# EAGLE board HFT-Core-Module_1V0 (EAGLE 7.7.0), part 1 of 3
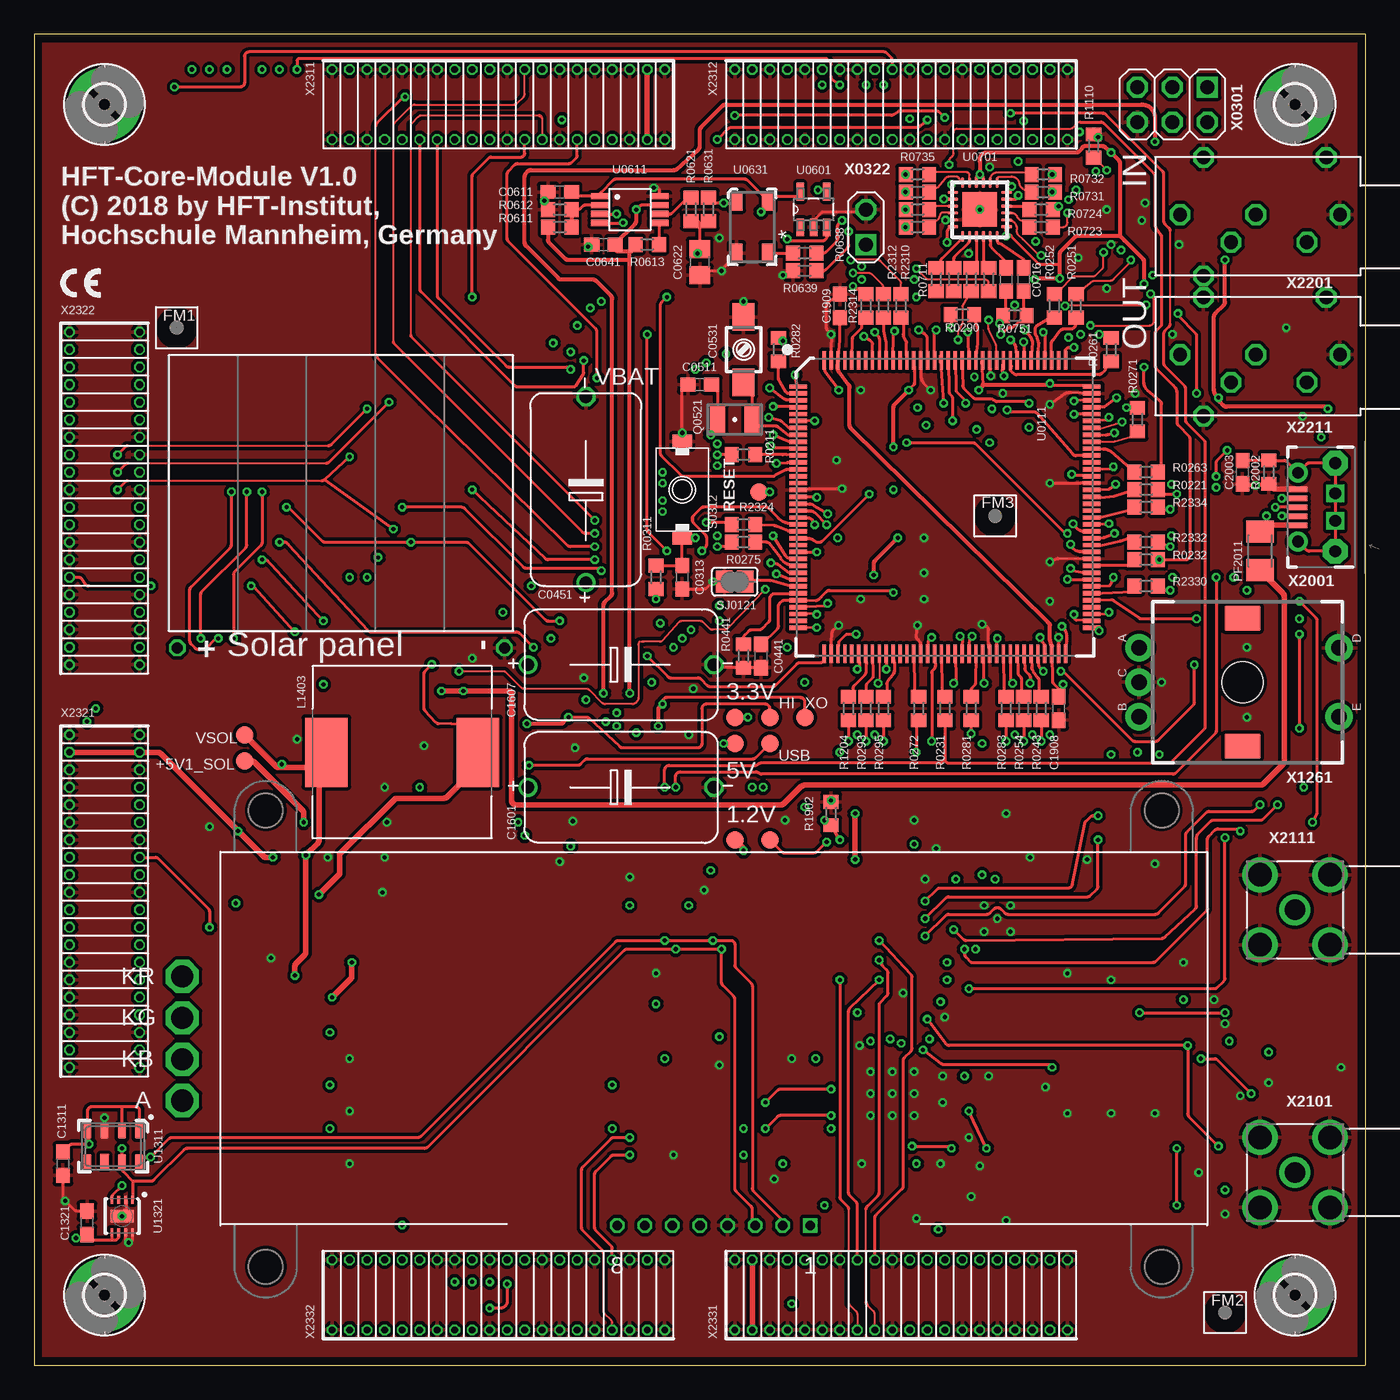
[diagram p24: board, top side]
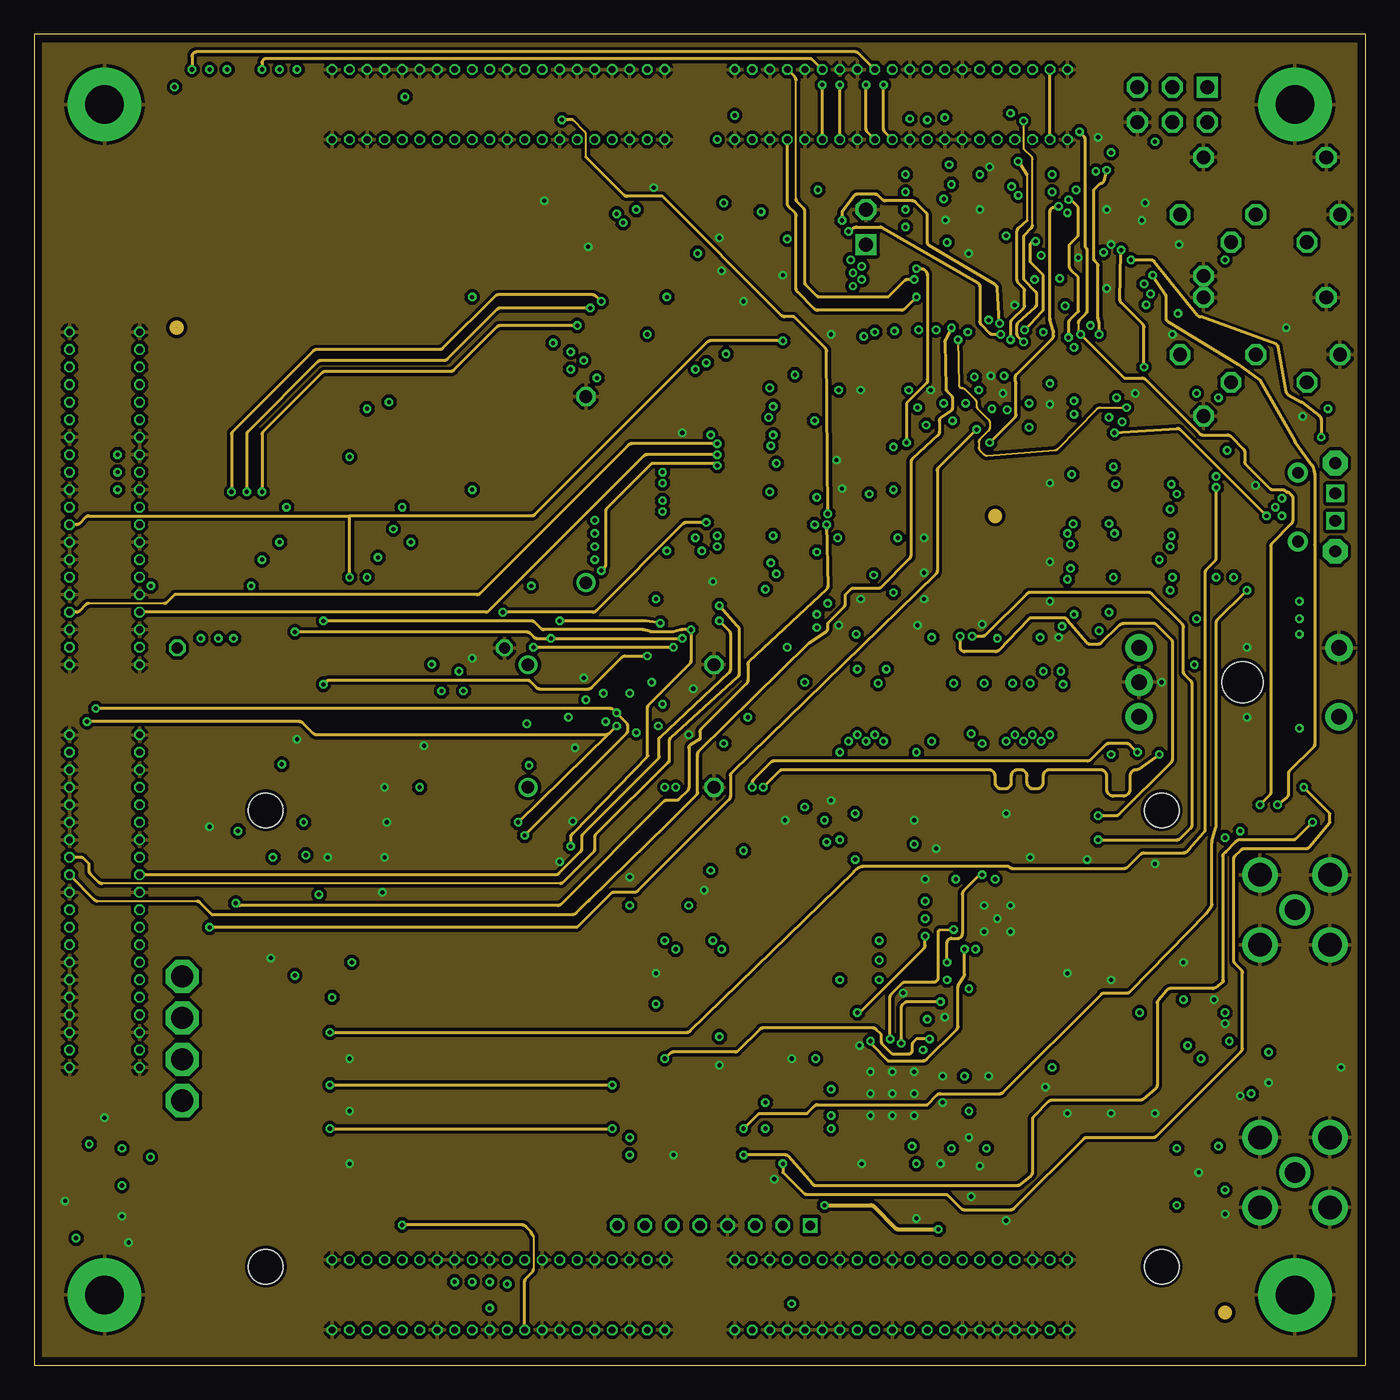
[diagram p25: board, inner layer Layer_2]
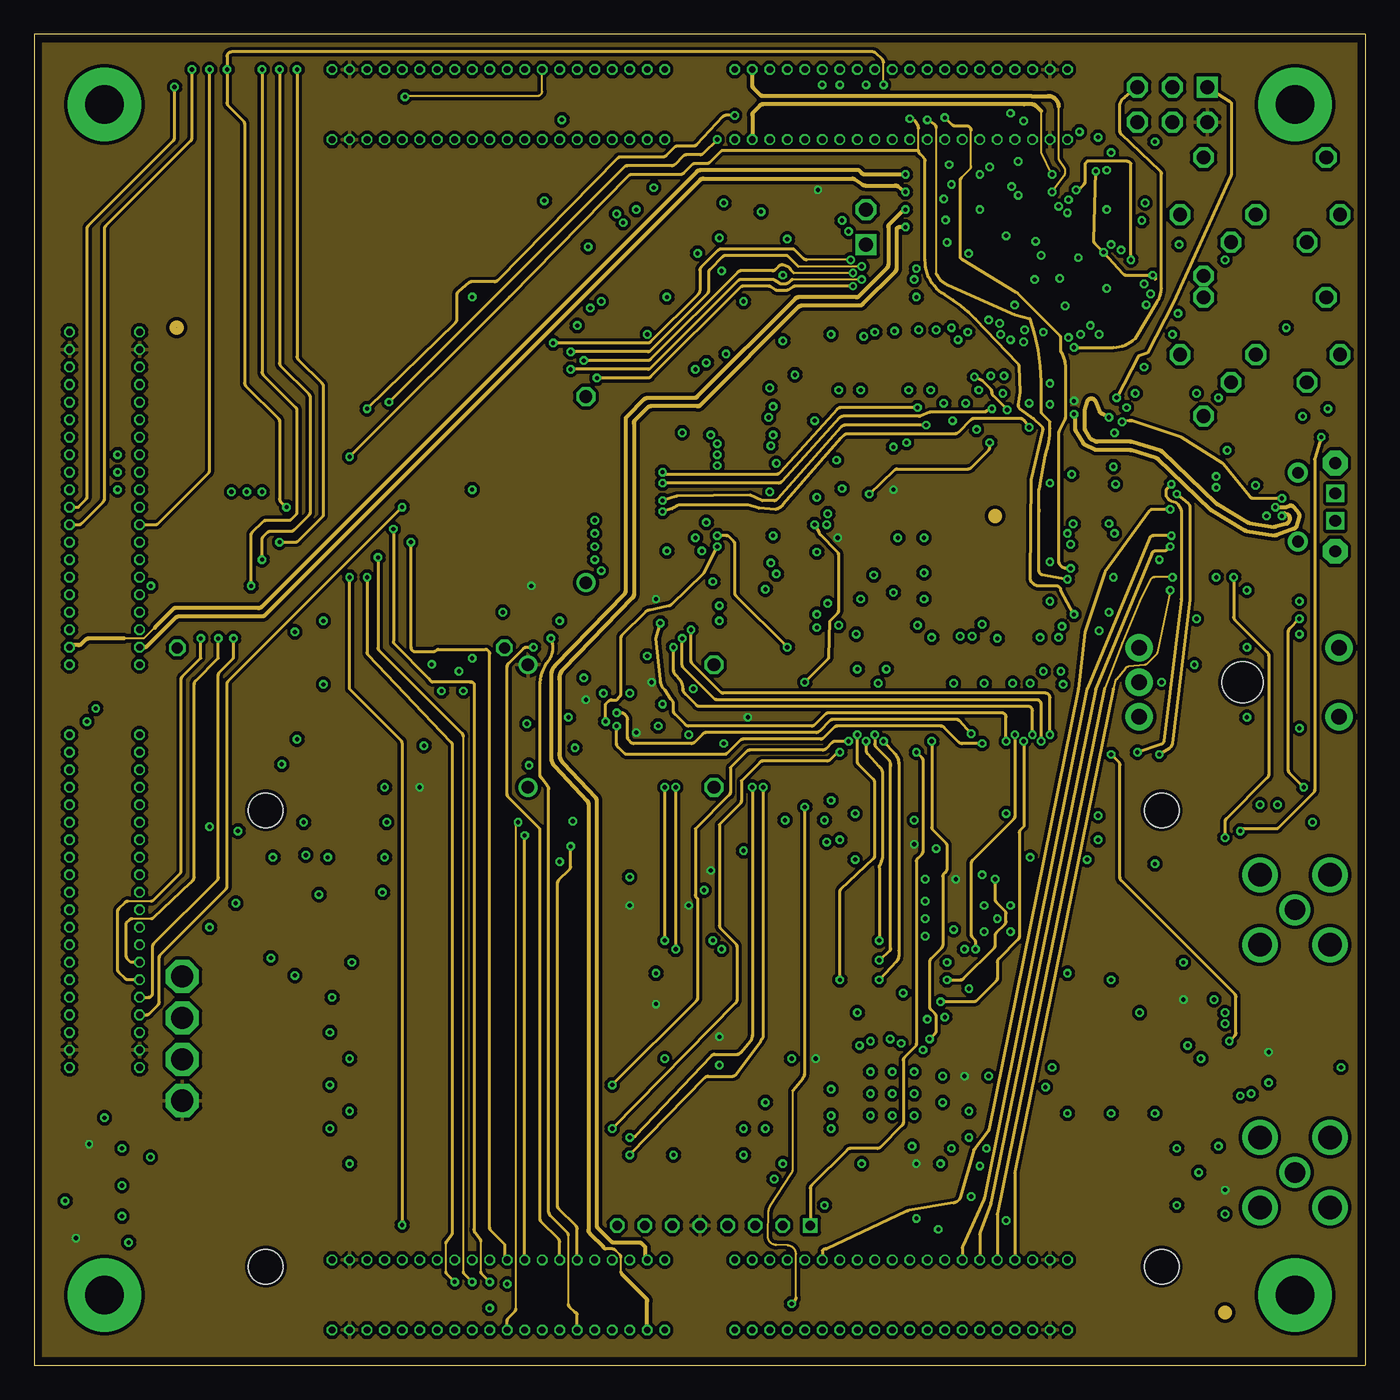
[diagram p26: board, inner layer Layer_15]
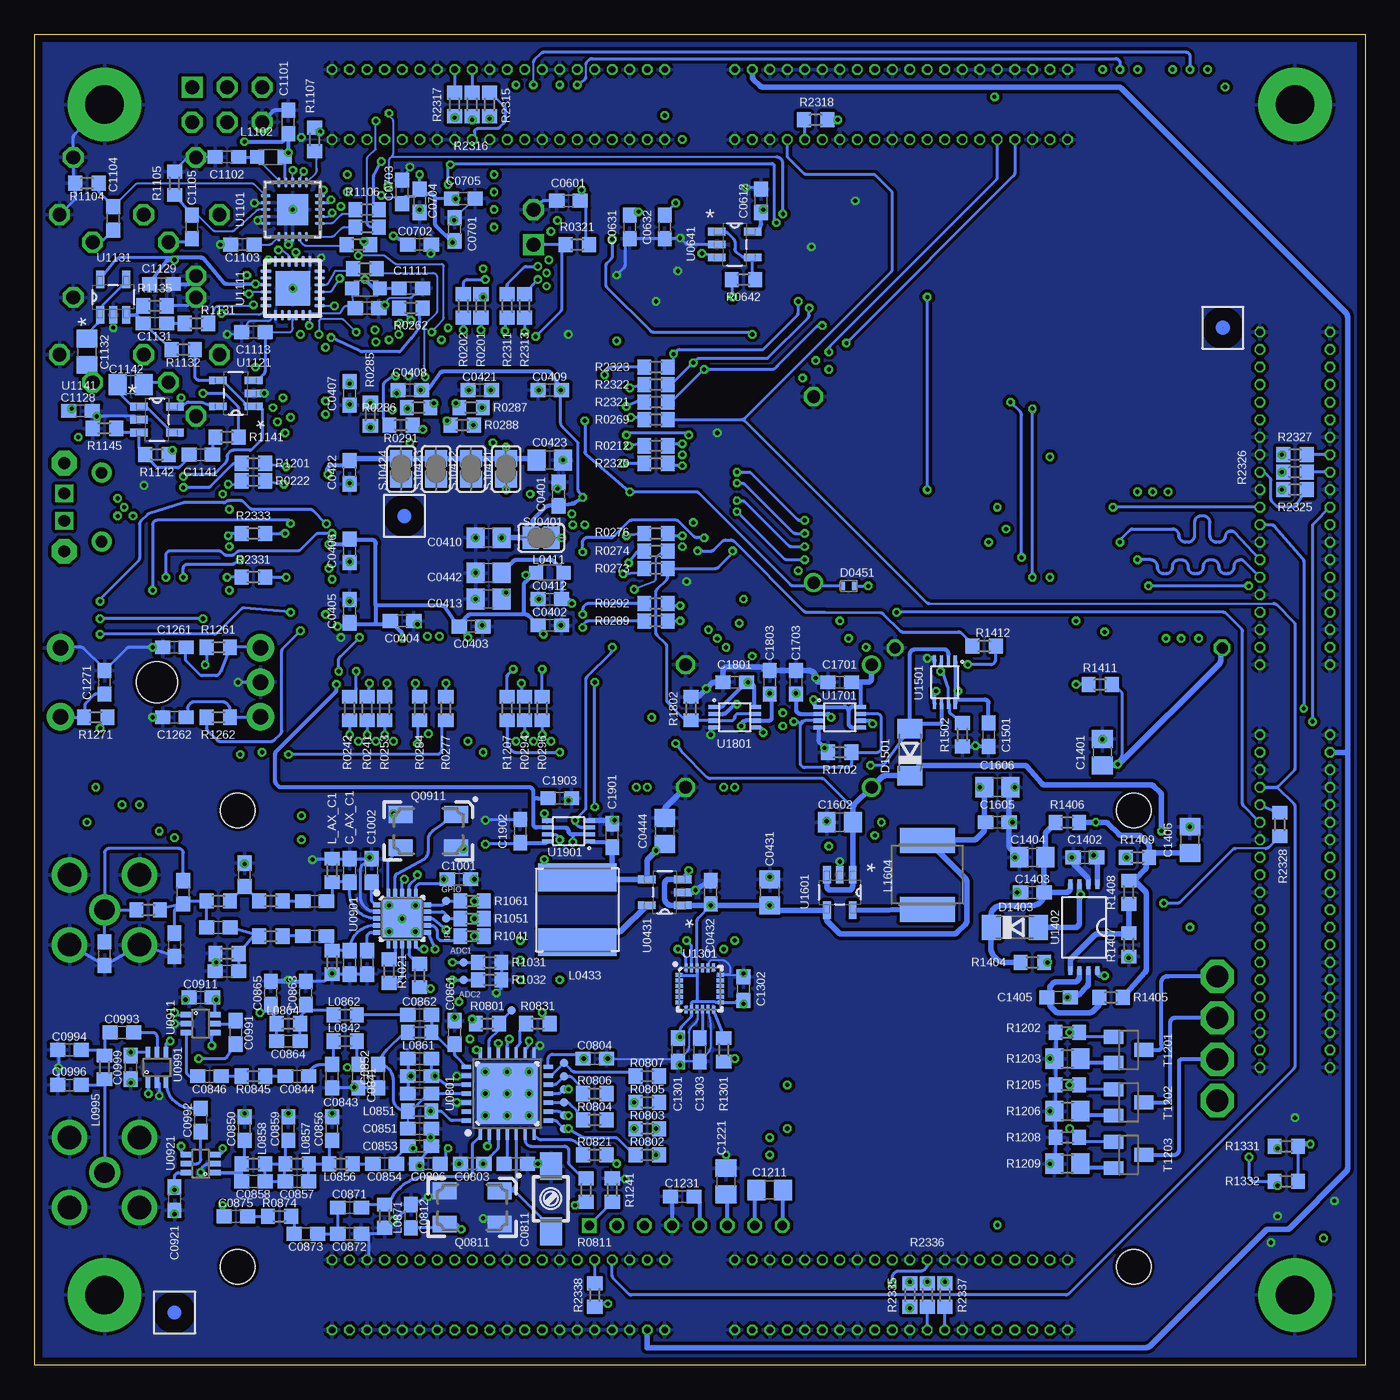
[diagram p27: board, bottom side, seen from below]

Size 96.52 x 96.52 mm. Coordinates in mm from the lower left corner, seen from the top.
Outline: 0,0 96.52,0 96.52,96.52 0,96.52 0,0
Copper layers ((1*2)+(15*16)): Top 0.035mm / dielectric 0.65mm / Layer_2 0.035mm / dielectric 0.15mm / Layer_15 0.035mm / dielectric 0.65mm / Bottom 0.035mm
Design rules "DirtyPCBs_4layers_6mil_20150401 *": minimum track width 6mil, minimum drill 12mil, track to track 0.25mm, track to pad 0.25mm, pad to pad 6mil, via to via 6mil, smd to smd 0mil, copper to edge 10mil, drill to drill 10mil, minimum pad ring 5mil, minimum via ring 6mil, stop-mask expansion 2mil, vias tented up to drill 25mil, thermal gap 10mil
Net classes: 1 pwr_relay: width 1.5 mm, clearance 0.5 mm; 2 pwr_ttl: width 0.75 mm, clearance 0.5 mm; 4 pwrA5: width 0.4 mm; 7 +3V3: clearance 0.5 mm; 8 GND: clearance 0.5 mm

## Footprints (pad centres in the part's own frame; a part is rotated, then mirrored left to right if it is on the bottom)
C0603 = smd 1.1 x 1: 1 -0.85,0; 2 0.85,0
C0805 = smd 1.3 x 1.5: 1 -0.95,0; 2 0.95,0
W14MM_D8MM_P13MM5 = drill 0.914: + -6.75,0 | drill 0.914 octagon: - 6.75,0
3MM2_X_2MM5 = smd 2 x 1.6: + -2.365,0; - 2.365,0
SOD923 = smd 0.4 x 0.6: A 0.45,0; C -0.45,0
SOD80C = smd 1.4 x 1.8: A 1.7,0; C -1.7,0
2,8-PAD = drill 2.8 pad 5.334: B2,8 0,0
L2012C = smd 1 x 1: 1 -1,0; 2 1,0
L_6X6MM = smd 2 x 5.7: 1 -2.35,0; 2 2.35,0
R0603 = smd 1 x 1.1: 1 -0.85,0; 2 0.85,0
L_13.5X12.5MM = smd 3.1 x 5: 1 -5.5,0; 2 5.5,0
L5650M = smd 1.8 x 4: 1 -2.5,0; 2 2.5,0
M1206 = smd 1.6 x 2: 1 -1.4,0; 2 1.4,0
ABS07 = smd 1.1 x 1.9: 1 -1.25,0; 2 1.25,0
ABM03B = smd 1.8 x 1.2: 1 -2,-1.2; 2 2,-1.2; 3 2,1.2; 4 -2,1.2
R0805 = smd 1.3 x 1.5: 1 -0.95,0; 2 0.95,0
KSR223G_SMD_1POL = smd 1 x 1.4: 1 -3.5,0; 2 3.5,0
SJ = smd 1.168 x 1.6: 1 -0.762,0; 2 0.762,0
SOT23 = smd 1 x 1.4: 1 -0.95,-1.1; 2 0.95,-1.1; 3 0,1.1
B1,27 = smd 1.27 x 1.27: TP 0,0
TP06R = smd 0.6 x 0.6: TP 0,0
LQFP144 = smd 0.325 x 1.35: 1 -8.75,-10.65; 2 -8.25,-10.65; 3 -7.75,-10.65; 4 -7.25,-10.65; 5 -6.75,-10.65; 6 -6.25,-10.65; 7 -5.75,-10.65; 8 -5.25,-10.65; 9 -4.75,-10.65; 10 -4.25,-10.65; 11 -3.75,-10.65; 12 -3.25,-10.65; 13 -2.75,-10.65; 14 -2.25,-10.65; 15 -1.75,-10.65; 16 -1.25,-10.65; 17 -0.75,-10.65; 18 -0.25,-10.65; 19 0.25,-10.65; 20 0.75,-10.65; 21 1.25,-10.65; 22 1.75,-10.65; 23 2.25,-10.65; 24 2.75,-10.65; 25 3.25,-10.65; 26 3.75,-10.65; 27 4.25,-10.65; 28 4.75,-10.65; 29 5.25,-10.65; 30 5.75,-10.65; 31 6.25,-10.65; 32 6.75,-10.65; 33 7.25,-10.65; 34 7.75,-10.65; 35 8.25,-10.65; 36 8.75,-10.65; 73 8.75,10.65; 74 8.25,10.65; 75 7.75,10.65; 76 7.25,10.65; 77 6.75,10.65; 78 6.25,10.65; 79 5.75,10.65; 80 5.25,10.65; 81 4.75,10.65; 82 4.25,10.65; 83 3.75,10.65; 84 3.25,10.65; 85 2.75,10.65; 86 2.25,10.65; 87 1.75,10.65; 88 1.25,10.65; 89 0.75,10.65; 90 0.25,10.65; 91 -0.25,10.65; 92 -0.75,10.65; 93 -1.25,10.65; 94 -1.75,10.65; 95 -2.25,10.65; 96 -2.75,10.65; 97 -3.25,10.65; 98 -3.75,10.65; 99 -4.25,10.65; 100 -4.75,10.65; 101 -5.25,10.65; 102 -5.75,10.65; 103 -6.25,10.65; 104 -6.75,10.65; 105 -7.25,10.65; 106 -7.75,10.65; 107 -8.25,10.65; 108 -8.75,10.65 | smd 1.35 x 0.325: 37 10.65,-8.75; 38 10.65,-8.25; 39 10.65,-7.75; 40 10.65,-7.25; 41 10.65,-6.75; 42 10.65,-6.25; 43 10.65,-5.75; 44 10.65,-5.25; 45 10.65,-4.75; 46 10.65,-4.25; 47 10.65,-3.75; 48 10.65,-3.25; 49 10.65,-2.75; 50 10.65,-2.25; 51 10.65,-1.75; 52 10.65,-1.25; 53 10.65,-0.75; 54 10.65,-0.25; 55 10.65,0.25; 56 10.65,0.75; 57 10.65,1.25; 58 10.65,1.75; 59 10.65,2.25; 60 10.65,2.75; 61 10.65,3.25; 62 10.65,3.75; 63 10.65,4.25; 64 10.65,4.75; 65 10.65,5.25; 66 10.65,5.75; 67 10.65,6.25; 68 10.65,6.75; 69 10.65,7.25; 70 10.65,7.75; 71 10.65,8.25; 72 10.65,8.75; 109 -10.65,8.75; 110 -10.65,8.25; 111 -10.65,7.75; 112 -10.65,7.25; 113 -10.65,6.75; 114 -10.65,6.25; 115 -10.65,5.75; 116 -10.65,5.25; 117 -10.65,4.75; 118 -10.65,4.25; 119 -10.65,3.75; 120 -10.65,3.25; 121 -10.65,2.75; 122 -10.65,2.25; 123 -10.65,1.75; 124 -10.65,1.25; 125 -10.65,0.75; 126 -10.65,0.25; 127 -10.65,-0.25; 128 -10.65,-0.75; 129 -10.65,-1.25; 130 -10.65,-1.75; 131 -10.65,-2.25; 132 -10.65,-2.75; 133 -10.65,-3.25; 134 -10.65,-3.75; 135 -10.65,-4.25; 136 -10.65,-4.75; 137 -10.65,-5.25; 138 -10.65,-5.75; 139 -10.65,-6.25; 140 -10.65,-6.75; 141 -10.65,-7.25; 142 -10.65,-7.75; 143 -10.65,-8.25; 144 -10.65,-8.75
SOT95P280X145-5N = smd 1.27 x 0.559: 1 -1.295,0.94; 2 -1.295,0; 3 -1.295,-0.94; 4 1.295,-0.94; 5 1.295,0.94
SOT95P285X120-5N = smd 1.27 x 0.533: 1 -1.295,0.965; 2 -1.295,0; 3 -1.295,-0.965; 4 1.295,-0.965; 5 1.295,0.965
µMAX8 = smd 1.35 x 0.4: 1 -2.15,0.975; 2 -2.15,0.325; 3 -2.15,-0.325; 4 -2.15,-0.975; 5 2.15,-0.975; 6 2.15,-0.325; 7 2.15,0.325; 8 2.15,0.975
CFPT-141 = smd 0.9 x 1.4: 1 -1.15,1.9; 2 -1.15,-1.9; 3 1.15,-1.9; 4 1.15,1.9
SOT-23-5 = smd 1.27 x 0.559: 1 -1.295,0.94; 2 -1.295,0; 3 -1.295,-0.94; 4 1.295,-0.94; 5 1.295,0.94
QFN24_P0MM5_CTRPAD = smd 0.8 x 0.25: 1 -1.95,1.25; 2 -1.95,0.75; 3 -1.95,0.25; 4 -1.95,-0.25; 5 -1.95,-0.75; 6 -1.95,-1.25; 13 1.95,-1.25; 14 1.95,-0.75; 15 1.95,-0.25; 16 1.95,0.25; 17 1.95,0.75; 18 1.95,1.25 | smd 0.25 x 0.8: 7 -1.25,-1.95; 8 -0.75,-1.95; 9 -0.25,-1.95; 10 0.25,-1.95; 11 0.75,-1.95; 12 1.25,-1.95; 19 1.25,1.95; 20 0.75,1.95; 21 0.25,1.95; 22 -0.25,1.95; 23 -0.75,1.95; 24 -1.25,1.95 | smd 2.5 x 2.5: 25 0,0
QFN28-6X6-0P65-PAD = smd 0.75 x 0.3: 1 -2.975,1.95; 2 -2.975,1.3; 3 -2.975,0.65; 4 -2.975,0; 5 -2.975,-0.65; 6 -2.975,-1.3; 7 -2.975,-1.95; 15 2.975,-1.95; 16 2.975,-1.3; 17 2.975,-0.65; 18 2.975,0; 19 2.975,0.65; 20 2.975,1.3; 21 2.975,1.95 | smd 0.3 x 0.75: 8 -1.95,-2.975; 9 -1.3,-2.975; 10 -0.65,-2.975; 11 0,-2.975; 12 0.65,-2.975; 13 1.3,-2.975; 14 1.95,-2.975; 22 1.95,2.975; 23 1.3,2.975; 24 0.65,2.975; 25 0,2.975; 26 -0.65,2.975; 27 -1.3,2.975; 28 -1.95,2.975 | smd 4.4 x 4.4: 29 0,0
QFN20-4X4-0P5-PAD = smd 0.6 x 0.35: 1 -1.85,1; 2 -1.85,0.5; 3 -1.85,0; 4 -1.85,-0.5; 5 -1.85,-1; 11 1.85,-1; 12 1.85,-0.5; 13 1.85,0; 14 1.85,0.5; 15 1.85,1 | smd 0.35 x 0.6: 6 -1,-1.85; 7 -0.5,-1.85; 8 0,-1.85; 9 0.5,-1.85; 10 1,-1.85; 16 1,1.85; 17 0.5,1.85; 18 0,1.85; 19 -0.5,1.85; 20 -1,1.85 | smd 2.75 x 2.75: 21 0,0
SC-70_6-LEAD_2X1MM25_0P65 = smd 0.4 x 0.9: 1 -0.65,-1.05; 2 0,-1.05; 3 0.65,-1.05; 4 0.65,1.05; 5 0,1.05; 6 -0.65,1.05
QFN20_P0MM5_CTRPAD = smd 0.73 x 0.25: 1 -1.965,1; 2 -1.965,0.5; 3 -1.965,0; 4 -1.965,-0.5; 5 -1.965,-1; 11 1.965,-1; 12 1.965,-0.5; 13 1.965,0; 14 1.965,0.5; 15 1.965,1 | smd 0.25 x 0.73: 6 -1,-1.965; 7 -0.5,-1.965; 8 0,-1.965; 9 0.5,-1.965; 10 1,-1.965; 16 1,1.965; 17 0.5,1.965; 18 0,1.965; 19 -0.5,1.965; 20 -1,1.965 | smd 2.25 x 2.25: 21 0,0
NHD-C0220BIZ_2X20CHARS = drill 0.7 square: 1 7,-14 | drill 0.7 octagon: 2 5,-14; 3 3,-14; 4 1,-14; 5 -1,-14; 6 -3,-14; 7 -5,-14; 8 -7,-14 | drill 1.6 pad 2 octagon: 9 -38.55,4.05; 10 -38.55,1.05; 11 -38.55,-1.95; 12 -38.55,-4.95 | hole 2.5: -32.5,16.1; 32.5,16.1; 32.5,-17; -32.5,-17
QFN24-3X3 = smd 0.495 x 0.25: 1 -1.552,1; 6 -1.552,-1; 13 1.552,-1; 18 1.552,1 | smd 0.6 x 0.25: 2 -1.5,0.6; 3 -1.5,0.2; 4 -1.5,-0.2; 5 -1.5,-0.6; 14 1.5,-0.6; 15 1.5,-0.2; 16 1.5,0.2; 17 1.5,0.6 | smd 0.25 x 0.495: 7 -1,-1.552; 12 1,-1.552; 19 1,1.552; 24 -1,1.552 | smd 0.25 x 0.6: 8 -0.6,-1.5; 9 -0.2,-1.5; 10 0.2,-1.5; 11 0.6,-1.5; 20 0.6,1.5; 21 0.2,1.5; 22 -0.2,1.5; 23 -0.6,1.5
MS5607-02BA = smd 1.1 x 0.6: 1 -1.1,1.875; 2 -1.1,0.625; 3 -1.1,-0.625; 4 -1.1,-1.875; 5 1.1,-1.875; 7 1.1,0.625; 8 1.1,1.875 | smd 1.1 x 0.67: 6 1.1,-0.625
DFN8/SHT = smd 0.55 x 0.25: 1 -1.177,0.765; 2 -1.177,0.265; 3 -1.177,-0.235; 4 -1.177,-0.735; 5 1.173,-0.735; 6 1.173,-0.235; 7 1.173,0.265; 8 1.173,0.765 | smd 0.9 x 1.7: 9 -0.002,0.015
SOLARPANEL_3V3_5MA1_25MM_X_20MM = drill 0.8 octagon: +VSOL 11.23,-11.865; -VSOL 11.23,11.865
TSSOP8 = smd 0.305 x 0.61: 1 -0.892,-3.13; 2 -0.242,-3.13; 3 0.407,-3.13; 4 1.058,-3.13; 5 1.058,3.13; 6 0.407,3.13; 7 -0.242,3.13; 8 -0.892,3.13
R-PDSO-G8 = smd 0.25 x 0.75: 1 -0.75,-1.55; 2 -0.25,-1.55; 3 0.25,-1.55; 4 0.75,-1.55; 5 0.75,1.55; 6 0.25,1.55; 7 -0.25,1.55; 8 -0.75,1.55
2X03 = drill 1.016 square: 1 -2.54,-1.27 | drill 1.016 octagon: 2 -2.54,1.27; 3 0,-1.27; 4 0,1.27; 5 2.54,-1.27; 6 2.54,1.27
1X02 = drill 1.016 square: 1 0,0 | drill 1.016 octagon: 2 0,2.54
TTE_EN11-HSM = drill 1.1 pad 2: A -2.5,-7.5; B 2.5,-7.5; C 0,-7.5; D -2.5,7; E 2.5,7 | smd 1.8 x 2.6: NC1 -4.65,0; NC2 4.65,0 | hole 3: 0,0
USB-B-MICRO-SMD_MOLEX-105017-0001 = smd 0.4 x 1.35: D+ 0,4.15; D- -0.65,4.15; GND 1.3,4.15; ID 0.65,4.15; VBUS -1.3,4.15 | drill 0.85 pad 1.45: JSHIELD -2.5,4.15; JSHIELD@2 2.5,4.15 | drill 0.85 pad 1.8 octagon: JSHIELD@3 -3.2,1.45; JSHIELD@6 3.2,1.45 | drill 0.85 square: JSHIELD@4 -1,1.45; JSHIELD@5 1,1.45
SMA_SMT_AMPHENOL_901-143 = drill 1.499: 1 0,0 | drill 1.702: 2 -2.54,2.54; 3 -2.54,-2.54; 4 2.54,-2.54; 5 2.54,2.54
SJ1-353XNS_3MM5-STEREO-AUDIO-JACKS = drill 1 octagon: 1 -4.532,-0.9; 2 -2.132,1.1; 3 3.368,1.1; 4 7.067,-0.9; 5 1.567,-0.9; 6 5.367,3.55; 7 -3.533,-5.05; 8 5.367,-5.05
2X20/90_1MM27_HARWIN_M50-3202045 = drill 0.5 pad 0.762 octagon: 1 -12.7,-2.54; 2 -12.7,2.54; 3 -11.43,-2.54; 4 -11.43,2.54; 5 -10.16,-2.54; 6 -10.16,2.54; 7 -8.89,-2.54; 8 -8.89,2.54; 9 -7.62,-2.54; 10 -7.62,2.54; 11 -6.35,-2.54; 12 -6.35,2.54; 13 -5.08,-2.54; 14 -5.08,2.54; 15 -3.81,-2.54; 16 -3.81,2.54; 17 -2.54,-2.54; 18 -2.54,2.54; 19 -1.27,-2.54; 20 -1.27,2.54; 21 0,-2.54; 22 0,2.54; 23 1.27,-2.54; 24 1.27,2.54; 25 2.54,-2.54; 26 2.54,2.54; 27 3.81,-2.54; 28 3.81,2.54; 29 5.08,-2.54; 30 5.08,2.54; 31 6.35,-2.54; 32 6.35,2.54; 33 7.62,-2.54; 34 7.62,2.54; 35 8.89,-2.54; 36 8.89,2.54; 37 10.16,-2.54; 38 10.16,2.54; 39 11.43,-2.54; 40 11.43,2.54

## Placement (x,y rotation side)
C0313  100nF  [C0603]  46.99,57.15 270 top
C0401  100n  [C0603]  58.5,63.18 90 bottom
C0402  100n  [C0603]  59.13,53.66 0 bottom
C0403  100n  [C0603]  64.85,53.58 0 bottom
C0404  100n  [C0603]  69.85,53.98 0 bottom
C0405  100n  [C0603]  73.66,54.69 90 bottom
C0406  100n  [C0603]  73.66,59.05 270 bottom
C0407  100n  [C0603]  73.66,70.48 270 bottom
C0408  100n  [C0603]  69.29,70.72 180 bottom
C0409  100n  [C0603]  59.13,70.72 180 bottom
C0410  4.7uF  [C0805]  63.58,60.01 180 bottom
C0412  10nF  [C0603]  59.13,55.56 180 bottom
C0413  1uF  [C0805]  63.58,57.47 180 bottom
C0421  100nF  [C0603]  64.21,70.72 0 bottom
C0422  100nF  [C0603]  73.66,64.77 270 bottom
C0423  4.7uF  [C0805]  59.13,65.64 0 bottom
C0431  10uF  [C0805]  43.18,34.29 90 bottom
C0432  100nF  [C0603]  47.47,34.29 90 bottom
C0441  100nF  [C0603]  52.7,51.44 90 top
C0442  1uF  [C0805]  63.58,55.56 0 bottom
C0444  10uF  [C0805]  50.8,38.73 90 bottom
C0451  1F_EEC-S5R5H105N  [W14MM_D8MM_P13MM5]  40.01,63.5 90 top
C0511  22pF  [C0603]  48.26,71.12 180 top
C0531  TZY2Z100AC01R00  [3MM2_X_2MM5]  51.44,73.66 270 top
C0601  100nF  [C0603]  57.78,84.45 180 bottom
C0611  100nF  [C0603]  38.1,85.09 180 top
C0612  100nF  [C0603]  43.81,84.45 90 bottom
C0622  1uF  [C0805]  48.26,80.01 270 top
C0631  100nF  [C0603]  53.34,82.55 270 bottom
C0632  100pF  [C0603]  50.8,82.55 270 bottom
C0641  100nF  [C0603]  41.27,81.28 180 top
C0701  100nF  [C0603]  66.04,82.39 90 bottom
C0702  100nF  [C0603]  68.58,81.28 0 bottom
C0703  100nF  [C0603]  69.85,85.09 90 bottom
C0704  220nF  [C0603]  68.58,84.45 270 bottom
C0705  100nF  [C0603]  65.41,84.61 180 bottom
C0715  10nF  [C0603]  70.48,78.74 90 top
C0716  10nF  [C0603]  71.75,78.74 90 top
C0801  1u  [C0603]  68.58,22.23 180 bottom
C0802  100n  [C0603]  68.58,20.95 0 bottom
C0803  100n  [C0603]  64.77,14.61 0 bottom
C0804  100n  [C0603]  55.88,22.23 180 bottom
C0805  100n  [C0603]  68.58,19.68 0 bottom
C0806  100n  [C0603]  67.94,14.61 0 bottom
C0807  100n  [C0603]  61.59,14.61 180 bottom
C0811  4.7p  [3MM2_X_2MM5]  59.05,12.06 270 bottom
C0812  12pF  [C0603]  69.22,10.79 270 bottom
C0841  0pF  [C0603]  73.03,20.95 270 bottom
C0843  3.3pF  [C0603]  74.93,20.95 270 bottom
C0844  47pF  [C0603]  77.47,20.95 180 bottom
C0846  47pF  [C0603]  83.82,20.95 180 bottom
C0850  0pF  [C0603]  81.28,17.14 90 bottom
C0851  47pF  [C0603]  68.58,17.14 0 bottom
C0852  47pF  [C0603]  71.6,20.95 270 bottom
C0853  4.7pF  [C0603]  68.58,15.88 0 bottom
C0854  15nH  [C0603]  71.12,14.61 180 bottom
C0856  6.8pF  [C0603]  74.93,17.14 90 bottom
C0857  2.7pF  [C0603]  77.47,13.34 180 bottom
C0858  0pF  [C0603]  80.64,13.34 180 bottom
C0859  6.8pF  [C0603]  78.11,17.14 90 bottom
C0861  1.5pF  [C0603]  66.04,24.13 90 bottom
C0862  33pF  [C0603]  68.58,25.4 180 bottom
C0863  4.7pF  [C0603]  76.83,26.99 90 bottom
C0864  1.2pF  [C0603]  78.11,23.5 180 bottom
C0865  1.8pF  [C0603]  79.38,26.99 90 bottom
C0871  4.7pF  [C0603]  73.66,11.43 180 bottom
C0872  0pF  [C0603]  73.66,9.53 180 bottom
C0873  47pF  [C0603]  76.83,9.53 180 bottom
C0875  47pF  [C0603]  81.92,10.79 180 bottom
C0911  1nF  [C0603]  84.45,26.67 180 bottom
C0921  1nF  [C0603]  86.36,12.06 270 bottom
C0991  100pF HiQ  [C0603]  81.92,24.13 270 bottom
C0992  330pF HiQ  [C0603]  84.45,17.78 90 bottom
C0993  330pF HiQ  [C0603]  90.17,24.13 180 bottom
C0994  0nF HiQ  [C0603]  93.98,22.86 180 bottom
C0996  0nF HiQ  [C0603]  93.98,20.32 180 bottom
C0999  1nF  [C0603]  89.53,21.59 270 bottom
C1001  100nF  [C0603]  65.72,35.24 0 bottom
C1002  100nF  [C0603]  72.07,35.88 270 bottom
C1003  100nF  [C0603]  72.39,29.21 90 bottom
C1101  100nF  [C0603]  78.11,90.17 90 bottom
C1102  100nF  [C0603]  82.55,87.63 0 bottom
C1103  100nF  [C0603]  81.44,81.28 0 bottom
C1104  220nF  [C0603]  90.81,83.19 90 bottom
C1105  220nF  [C0603]  85.09,82.55 90 bottom
C1111  100nF  [C0603]  69.22,78.11 0 bottom
C1112  100nF  [C0603]  72.39,76.68 180 bottom
C1113  47pF  [C0603]  80.64,74.93 180 bottom
C1128  100nF  [C0603]  93.19,69.22 0 bottom
C1129  100nF  [C0603]  87.31,78.42 0 bottom
C1131  220nF  [C0603]  87.79,75.56 180 bottom
C1132  100uF  [C0805]  92.71,73.5 270 bottom
C1141  220nF  [C0603]  84.45,66.04 180 bottom
C1142  100uF  [C0805]  89.53,71.12 0 bottom
C1211  1uF  [C0805]  43.18,12.7 180 bottom
C1221  1uF  [C0805]  46.35,13.34 90 bottom
C1231  100nF  [C0603]  49.53,12.22 180 bottom
C1261  1nF  [C0603]  86.36,52.07 180 bottom
C1262  1nF  [C0603]  86.36,46.99 180 bottom
C1271  1nF  [C0603]  91.44,49.53 90 bottom
C1301  100nF  [C0603]  49.85,22.86 270 bottom
C1302  10nF  [C0603]  45.09,27.3 90 bottom
C1303  100nF  [C0603]  48.26,22.86 270 bottom
C1311  100nF  [C0603]  2.06,14.61 270 top
C1321  100nF  [C0603]  3.81,10.32 90 top
C1401  100uF  [C0805]  19.05,44.45 90 bottom
C1402  100nF  [C0603]  20.32,36.83 180 bottom
C1403  100nF  [C0603]  24.13,34.29 180 bottom
C1404  10uF  [C0805]  24.13,36.83 180 bottom
C1405  0nF  [C0603]  22.23,26.67 180 bottom
C1406  47uF  [C0805]  12.7,38.1 90 bottom
C1501  100nF  [C0603]  27.3,45.72 270 bottom
C1601  1F_EEC-S5R5H105N  [W14MM_D8MM_P13MM5]  42.55,41.91 0 top
C1602  47uF  [C0805]  38.1,39.37 180 bottom
C1605  100nF  [C0603]  26.67,39.37 0 bottom
C1606  47uF  [C0805]  26.67,41.91 0 bottom
C1607  1F_EEC-S5R5H105N  [W14MM_D8MM_P13MM5]  42.55,50.8 0 top
C1701  100nF  [C0603]  38.1,49.53 180 bottom
C1703  100nF  [C0603]  41.27,49.53 90 bottom
C1801  100nF  [C0603]  45.72,49.53 180 bottom
C1803  100nF  [C0603]  43.18,49.53 90 bottom
C1901  100nF  [C0603]  54.61,38.42 90 bottom
C1902  100nF  [C0603]  61.28,38.73 90 bottom
C1903  100nF  [C0603]  58.42,41.12 0 bottom
C1908  100nF  [C0603]  74.3,47.62 90 top
C1909  100nF  [C0603]  58.42,76.83 90 top
C2003  1nF  [C0603]  87.63,64.77 90 top
C_AX_A2  4.7pF  [C0603]  86.36,30.48 270 bottom
C_AX_A3  4.7pF  [C0603]  91.44,29.84 270 bottom
C_AX_B2  4.7pF  [C0603]  83.19,31.75 180 bottom
C_AX_C1  0pF  [C0603]  73.66,35.88 90 bottom
C_AX_C2  0pF  [C0603]  73.66,29.21 270 bottom
C_AX_F2  4.7pF  [C0603]  85.72,34.29 90 bottom
C_AX_M1  4.7pF  [C0603]  81.28,35.56 90 bottom
C_AX_M2  0pF  [C0603]  82.55,28.57 180 bottom
C_AX_T1  4.3pF  [C0603]  76.2,33.66 180 bottom
C_AX_T2  4.3pF  [C0603]  76.2,31.11 180 bottom
D0451  CMAD6001  [SOD923]  37.47,56.52 0 bottom
D1403  CRS08  [SOD80C]  25.4,31.75 0 bottom
D1501  CRS08  [SOD80C]  33.02,44.45 90 bottom
FM1  [FIDUCIAL_MARK_1MM]  10.32,75.25 0 top
FM2  [FIDUCIAL_MARK_1MM]  86.36,3.81 0 top
FM3  [FIDUCIAL_MARK_1MM]  69.69,61.59 0 top
H2401  MOUNT-PAD-ROUND2.8  [2,8-PAD]  91.44,91.44 0 top
H2402  MOUNT-PAD-ROUND2.8  [2,8-PAD]  5.08,91.44 0 top
H2403  MOUNT-PAD-ROUND2.8  [2,8-PAD]  5.08,5.08 0 top
H2404  MOUNT-PAD-ROUND2.8  [2,8-PAD]  91.44,5.08 0 top
L0411  10uH  [L2012C]  59.13,57.47 180 bottom
L0433  2.2uH 14mR  [L_6X6MM]  57.15,33.02 270 bottom
L0842  10nH  [R0603]  73.98,23.5 180 bottom
L0851  68nH  [R0603]  68.58,18.41 180 bottom
L0856  0R  [R0603]  74.3,14.61 180 bottom
L0857  12nH  [R0603]  77.47,14.61 180 bottom
L0858  0R  [R0603]  80.64,14.61 180 bottom
L0861  33nH  [R0603]  68.58,24.13 180 bottom
L0862  10nH  [R0603]  73.98,25.4 180 bottom
L0864  6.2nH  [R0603]  78.11,24.77 180 bottom
L0871  18nH  [R0603]  71.12,10.79 270 bottom
L0995  0R  [R0603]  91.44,21.59 270 bottom
L1102  10uH  [L2012C]  79.38,87.63 0 bottom
L1112  10uH  [L2012C]  72.47,78.11 0 bottom
L1403  33uH  [L_13.5X12.5MM]  26.67,44.45 180 top
L1604  1.0uH 33mR  [L5650M]  31.75,35.56 270 bottom
L_AX_1  22nH  [R0603]  70.8,28.57 90 bottom
L_AX_B1  22nH  [R0603]  83.19,33.66 180 bottom
L_AX_B2  22nH  [R0603]  82.55,29.84 0 bottom
L_AX_C1  100nH  [R0603]  74.93,35.88 90 bottom
L_AX_C2  100nH  [R0603]  74.93,29.21 270 bottom
L_AX_F1  22nH  [R0603]  88.27,33.02 180 bottom
L_AX_T1  43nH  [R0603]  79.38,33.66 180 bottom
L_AX_T2  43nH  [R0603]  79.38,31.11 180 bottom
PF2011  1.1A/2.2A  [M1206]  88.9,59.05 270 top
Q0521  ABS07-32.768KHZ  [ABS07]  50.8,68.58 0 top
Q0811  ABM03B-32.000MHZ  [ABM03B]  64.77,11.43 180 bottom
Q0911  ABM3B-16MHZ-10-R50-1-U  [ABM03B]  67.94,38.73 180 bottom
R0201  0R  [R0603]  64.14,76.83 90 bottom
R0202  0R  [R0603]  65.41,76.83 90 bottom
R0211  0R  [R0603]  51.44,66.04 180 top
R0212  0R  [R0603]  51.44,66.67 0 bottom
R0221  0R  [R0603]  80.64,63.5 0 top
R0222  0R  [R0603]  80.64,64.14 180 bottom
R0231  0R  [R0603]  66.04,47.62 270 top
R0232  0R  [R0603]  80.64,58.42 0 top
R0241  47R  [R0603]  72.39,47.62 270 bottom
R0242  47R  [R0603]  73.66,47.62 270 bottom
R0243  47R  [R0603]  73.03,47.62 270 top
R0251  47R  [R0603]  75.56,76.83 90 top
R0252  47R  [R0603]  73.98,76.83 90 top
R0253  47R  [R0603]  71.12,47.62 270 bottom
R0254  47R  [R0603]  71.75,47.62 270 top
R0261  47R  [R0603]  78.11,73.66 90 top
R0262  47R  [R0603]  69.22,76.68 0 bottom
R0263  47R  [R0603]  80.64,64.77 0 top
R0269  47R  [R0603]  51.44,68.58 0 bottom
R0271  47R  [R0603]  80.01,68.58 90 top
R0272  47R  [R0603]  64.14,47.62 270 top
R0273  47R  [R0603]  51.44,57.78 0 bottom
R0274  47R  [R0603]  51.44,59.05 0 bottom
R0275  47R  [R0603]  51.44,59.69 180 top
R0276  47R  [R0603]  51.44,60.33 0 bottom
R0277  47R  [R0603]  66.67,47.62 270 bottom
R0281  47R  [R0603]  67.94,47.62 270 top
R0282  47R  [R0603]  53.98,73.66 90 top
R0283  47R  [R0603]  70.48,47.62 270 top
R0284  47R  [R0603]  68.58,47.62 270 bottom
R0285  47R  [R0603]  72.15,68.98 270 bottom
R0286  47R  [R0603]  68.66,69.45 180 bottom
R0287  47R  [R0603]  64.85,69.45 0 bottom
R0288  47R  [R0603]  65.48,68.18 0 bottom
R0289  47R  [R0603]  51.44,53.98 0 bottom
R0290  47R  [R0603]  67.31,76.2 180 top
R0291  47R  [R0603]  69.93,68.18 0 bottom
R0292  47R  [R0603]  51.44,55.24 0 bottom
R0293  47R  [R0603]  60.33,47.62 270 top
R0294  47R  [R0603]  60.96,47.62 270 bottom
R0295  47R  [R0603]  61.59,47.62 270 top
R0296  47R  [R0603]  59.69,47.62 270 bottom
R0311  N/A  [R0603]  45.09,57.15 90 top
R0321  10kR  [R0603]  57.15,81.28 180 bottom
R0441  0R  [R0603]  51.44,51.44 90 top
R0611  open  [R0603]  38.1,82.55 0 top
R0612  0R  [R0603]  38.1,83.82 0 top
R0613  0R  [R0603]  44.45,81.28 0 top
R0621  100kR  [R0603]  47.62,83.82 270 top
R0631  10kR  [R0603]  48.9,83.82 90 top
R0638  50R  [R0603]  55.88,80.64 0 top
R0639  50R  [R0603]  55.88,79.38 0 top
R0642  47R  [R0603]  45.09,78.74 180 bottom
R0711  none  [R0603]  65.41,78.74 90 top
R0712  none  [R0603]  66.67,78.74 90 top
R0713  47R  [R0603]  67.94,78.74 90 top
R0714  47R  [R0603]  69.22,78.74 90 top
R0723  47R  [R0603]  73.03,82.55 180 top
R0724  47R  [R0603]  73.03,83.82 180 top
R0731  47R  [R0603]  73.18,85.09 0 top
R0732  47R  [R0603]  73.18,86.36 0 top
R0735  47R  [R0603]  64.06,86.36 180 top
R0736  47R  [R0603]  64.06,85.09 180 top
R0743  47R  [R0603]  64.06,83.82 180 top
R0744  47R  [R0603]  64.06,82.55 180 top
R0751  100R  [R0603]  71.12,76.12 180 top
R0801  100R  [R0603]  63.66,24.77 180 bottom
R0802  47R  [R0603]  52.07,15.24 0 bottom
R0803  47R  [R0603]  52.07,17.14 0 bottom
R0804  NC  [R0603]  55.88,17.78 0 bottom
R0805  NC  [R0603]  52.07,19.05 0 bottom
R0806  NC  [R0603]  55.88,19.68 0 bottom
R0807  NC  [R0603]  52.07,20.95 0 bottom
R0811  0R  [R0603]  56.52,12.7 270 bottom
R0821  100R  [R0603]  55.88,15.24 180 bottom
R0831  47R  [R0603]  60.01,24.77 180 bottom
R0845  0R  [R0603]  80.64,20.95 180 bottom
R0874  0R  [R0603]  78.74,10.79 180 bottom
R1021  47R  [R0603]  68.58,28.26 270 bottom
R1031  100kR  [R0603]  63.5,29.21 0 bottom
R1032  100kR  [R0603]  63.5,27.94 0 bottom
R1041  47R  [R0603]  64.77,31.11 180 bottom
R1051  47R  [R0603]  64.77,32.38 180 bottom
R1061  47R  [R0603]  64.77,33.66 180 bottom
R1104  22kR  [R0603]  92.71,85.72 0 bottom
R1105  22kR  [R0603]  86.36,85.72 270 bottom
R1106  47R  [R0603]  72.39,83.82 0 bottom
R1107  47R  [R0603]  76.2,88.9 90 bottom
R1108  47R  [R0603]  72.39,82.55 0 bottom
R1109  47R  [R0603]  73.03,81.28 0 bottom
R1110  33kR  [R0603]  76.83,88.42 270 top
R1114  47R  [R0603]  72.55,79.53 180 bottom
R1131  10kR  [R0603]  84.77,75.56 180 bottom
R1132  10MR  [R0603]  85.72,73.66 180 bottom
R1135  10MR  [R0603]  87.79,76.83 180 bottom
R1141  10kR  [R0603]  82.55,67.31 180 bottom
R1142  10MR  [R0603]  87.63,66.04 180 bottom
R1145  10MR  [R0603]  91.44,67.94 0 bottom
R1201  2.0kR  [R0603]  80.64,65.41 0 bottom
R1202  1.5kR  [R0603]  21.59,24.13 0 bottom
R1203  27R  [R0805]  21.59,22.23 0 bottom
R1204  2.0kR  [R0603]  59.05,47.62 90 top
R1205  1.5kR  [R0603]  21.59,20.32 0 bottom
R1206  27R  [R0805]  21.59,18.41 0 bottom
R1207  2.0kR  [R0603]  62.23,47.62 90 bottom
R1208  1.5kR  [R0603]  21.59,16.51 0 bottom
R1209  27R  [R0805]  21.59,14.61 0 bottom
R1241  33kR  [R0603]  54.61,12.7 270 bottom
R1261  10kR  [R0603]  83.19,52.07 180 bottom
R1262  10kR  [R0603]  83.19,46.99 180 bottom
R1271  10kR  [R0603]  92.08,46.99 0 bottom
R1301  68R  [R0603]  46.51,22.86 270 bottom
R1331  1.0kR  [R0603]  5.71,15.88 0 bottom
R1332  1.0kR  [R0603]  5.71,13.34 0 bottom
R1404  0R  [R0603]  24.13,29.21 180 bottom
R1405  0R  [R0603]  18.41,26.67 0 bottom
R1406  0R  [R0603]  21.59,39.37 0 bottom
R1407  100kR  [R0603]  17.14,30.48 90 bottom
R1408  310kR  [R0603]  17.14,34.29 90 bottom
R1409  0R  [R0603]  16.51,36.83 180 bottom
R1411  1kR  [R0603]  19.21,49.37 180 bottom
R1412  100kR  [R0603]  27.62,52.15 0 bottom
R1502  33kR  [R0603]  29.21,45.72 90 bottom
R1702  33kR  [R0603]  38.1,44.45 0 bottom
R1802  33kR  [R0603]  48.9,47.62 270 bottom
R1902  33kR  [R0603]  57.78,40.01 270 top
R2002  330kR  [R0603]  89.53,64.77 90 top
R2310  47R  [R0603]  62.87,76.83 90 top
R2311  47R  [R0603]  62.23,76.83 90 bottom
R2312  47R  [R0603]  61.59,76.83 90 top
R2313  47R  [R0603]  60.96,76.83 90 bottom
R2314  47R  [R0603]  60.33,76.83 90 top
R2315  47R  [R0603]  63.5,91.44 90 bottom
R2316  47R  [R0603]  64.77,91.44 90 bottom
R2317  47R  [R0603]  66.04,91.44 90 bottom
R2318  47R  [R0603]  39.85,90.33 180 bottom
R2320  47R  [R0603]  51.44,65.41 0 bottom
R2321  47R  [R0603]  51.44,69.85 0 bottom
R2322  47R  [R0603]  51.44,71.12 0 bottom
R2323  47R  [R0603]  51.44,72.39 0 bottom
R2324  47R  [R0603]  51.44,60.96 180 top
R2325  47R  [R0603]  5.08,63.5 0 bottom
R2326  47R  [R0603]  5.08,64.77 0 bottom
R2327  47R  [R0603]  5.08,66.04 0 bottom
R2328  47R  [R0603]  6.19,39.21 90 bottom
R2330  47R  [R0603]  80.64,56.52 0 top
R2331  47R  [R0603]  80.64,57.15 180 bottom
R2332  47R  [R0603]  80.64,59.69 0 top
R2333  47R  [R0603]  80.64,60.33 180 bottom
R2334  47R  [R0603]  80.64,62.23 0 top
R2335  47R  [R0603]  33.02,5.08 270 bottom
R2336  47R  [R0603]  31.75,5.08 270 bottom
R2337  47R  [R0603]  30.48,5.08 270 bottom
R2338  47R  [R0603]  55.88,5.08 90 bottom
S0312  KSR223G  [KSR223G_SMD_1POL]  46.99,63.5 270 top
SJ0121  [SJ]  50.8,56.83 0 top
SJ0401  [SJ]  59.77,60.01 180 bottom
SJ0421  [SJ]  62.31,65.01 270 bottom
SJ0422  [SJ]  64.85,65.01 270 bottom
SJ0423  [SJ]  67.39,65.01 270 bottom
SJ0424  [SJ]  69.93,65.01 270 bottom
T1201  MMBT2222  [SOT23]  17.14,22.86 270 bottom
T1202  MMBT2222  [SOT23]  17.14,19.05 270 bottom
T1203  MMBT2222  [SOT23]  17.14,15.24 270 bottom
TP_+1V2  PTR1B1,27  [B1,27]  50.8,38.1 0 top
TP_+1V2_MCU  PTR1B1,27  [B1,27]  53.34,38.1 0 top
TP_+3V3  PTR1B1,27  [B1,27]  50.8,46.99 0 top
TP_+3V3_20MHZ  PTR1B1,27  [B1,27]  55.88,46.99 0 top
TP_+3V3_HICUR  PTR1B1,27  [B1,27]  53.34,46.99 0 top
TP_+5V0  PTR1B1,27  [B1,27]  50.8,45.09 0 top
TP_+5V0_SOL  PTR1B1,27  [B1,27]  15.24,43.81 0 top
TP_+5V0_USB_SW  PTR1B1,27  [B1,27]  53.34,45.09 0 top
TP_AX_ADC1  PTR1TP06R  [TP06R]  65.41,29.21 0 bottom
TP_AX_ADC2  PTR1TP06R  [TP06R]  65.41,27.94 0 bottom
TP_AX_IRQ  PTR1TP06R  [TP06R]  66.67,32.38 0 bottom
TP_AX_TCXO_EN  PTR1TP06R  [TP06R]  66.67,33.66 0 bottom
TP_SX_DIO0  PTR1TP06R  [TP06R]  58.1,17.14 0 bottom
TP_SX_DIO1  PTR1TP06R  [TP06R]  58.1,18.1 0 bottom
TP_SX_DIO2  PTR1TP06R  [TP06R]  58.1,19.05 0 bottom
TP_SX_DIO3  PTR1TP06R  [TP06R]  58.1,20 0 bottom
TP_SX_DIO4  PTR1TP06R  [TP06R]  58.1,20.95 0 bottom
TP_SX_DIO5  PTR1TP06R  [TP06R]  58.1,21.91 0 bottom
TP_SX_RXTX  PTR1TP06R  [TP06R]  61.91,25.72 0 bottom
TP_VBAT  PTR1B1,27  [B1,27]  52.55,63.34 0 top
TP_VSOL  PTR1B1,27  [B1,27]  15.24,45.72 0 top
U0111  STM32L4Z_144PIN_SMPS  [LQFP144]  66.04,62.23 270 top
U0431  PAM2305AAB120  [SOT95P280X145-5N]  50.8,34.29 180 bottom
U0601  LM4120IM5-3.0  [SOT95P285X120-5N]  56.52,83.82 90 top
U0611  MAX5217  [µMAX8]  43.18,83.82 0 top
U0631  CFPT-141-20MHZ  [CFPT-141]  52.07,82.55 0 top
U0641  OPA354  [SOT-23-5]  45.72,81.28 0 bottom
U0701  Si5338  [QFN24_P0MM5_CTRPAD]  68.58,83.82 90 top
U0801  SX1276  [QFN28-6X6-0P65-PAD]  62.23,19.68 90 bottom
U0901  AX5243  [QFN20-4X4-0P5-PAD]  69.85,32.38 0 bottom
U0911  PE4259  [SC-70_6-LEAD_2X1MM25_0P65]  84.45,24.77 270 bottom
U0921  PE4259  [SC-70_6-LEAD_2X1MM25_0P65]  84.45,14.61 90 bottom
U0991  PE4259  [SC-70_6-LEAD_2X1MM25_0P65]  87.63,21.59 0 bottom
U1101  MCP3911A0-E-SS  [QFN20_P0MM5_CTRPAD]  77.79,83.82 0 bottom
U1111  MAX5136AGTG+  [QFN24_P0MM5_CTRPAD]  77.79,78.11 180 bottom
U1121  OPA354  [SOT-23-5]  81.92,70.48 180 bottom
U1131  OPA354  [SOT-23-5]  90.81,77.47 90 bottom
U1141  OPA354  [SOT-23-5]  87.63,68.58 0 bottom
U1201  NHD-C0220BIZ_2X20CHARS  [NHD-C0220BIZ_2X20CHARS]  49.28,24.13 0 top
U1301  MPU-9250  [QFN24-3X3]  48.26,27.3 0 bottom
U1311  MS5607-02BA03  [MS5607-02BA]  5.71,15.88 270 top
U1321  SHT31-DIS  [DFN8/SHT]  6.35,10.79 270 top
U1401  SOLARPANEL_3V3_5MA1_25MM_X_20MM  [SOLARPANEL_3V3_5MA1_25MM_X_20MM]  22.23,63.25 270 top
U1402  SPV1040T  [TSSOP8]  20.32,31.75 180 bottom
U1501  TS5A23166  [R-PDSO-G8]  30.48,49.53 180 bottom
U1601  SC189ZSKTRT  [SOT95P280X145-5N]  38.1,34.29 270 bottom
U1701  TS5A23166  [R-PDSO-G8]  38.1,46.99 270 bottom
U1801  TS5A23166  [R-PDSO-G8]  45.72,46.99 270 bottom
U1901  TS5A23166  [R-PDSO-G8]  57.78,38.73 90 bottom
X0301  [2X03]  82.55,91.44 180 top
X0322  [1X02]  60.33,81.28 0 top
X1261  TTE_EN11-HSM  [TTE_EN11-HSM]  87.63,49.53 270 top
X2001  MOLEX 105017-0001  [USB-B-MICRO-SMD_MOLEX-105017-0001]  95.81,62.23 90 top
X2101  SMA_SMT_AMPHENOL-901-143, SAMTEC SMA-J-P-H-RA-TH1  [SMA_SMT_AMPHENOL_901-143]  91.44,13.97 270 top
X2111  SMA_SMT_AMPHENOL-901-143, SAMTEC SMA-J-P-H-RA-TH1  [SMA_SMT_AMPHENOL_901-143]  91.44,33.02 270 top
X2201  CUI SJ1-3535NS  [SJ1-353XNS_3MM5-STEREO-AUDIO-JACKS]  90.17,82.55 180 top
X2211  CUI SJ1-3535NS  [SJ1-353XNS_3MM5-STEREO-AUDIO-JACKS]  90.17,72.39 180 top
X2311  2X20/90_1MM27_HARWIN_M50-3202045  [2X20/90_1MM27_HARWIN_M50-3202045]  34.29,91.44 0 top
X2312  2X20/90_1MM27_HARWIN_M50-3202045  [2X20/90_1MM27_HARWIN_M50-3202045]  63.5,91.44 0 top
X2321  2X20/90_1MM27_HARWIN_M50-3202045  [2X20/90_1MM27_HARWIN_M50-3202045]  5.08,34.29 90 top
X2322  2X20/90_1MM27_HARWIN_M50-3202045  [2X20/90_1MM27_HARWIN_M50-3202045]  5.08,63.5 90 top
X2331  2X20/90_1MM27_HARWIN_M50-3202045  [2X20/90_1MM27_HARWIN_M50-3202045]  62.23,5.08 180 top
X2332  2X20/90_1MM27_HARWIN_M50-3202045  [2X20/90_1MM27_HARWIN_M50-3202045]  33.02,5.08 180 top

## Tracks (layer width: path | path; a pad name or v marks a point on that pad's centre or on a via)
20MHZ_DAC_OUT
  Top 0.203: U0611.6 46.06,83.5 arc45 46.28,83.59 47.27,84.58 arc-45 47.49,84.67 R0621.1
20MHZ_XO
  Top 0.203: U0631.3 arc45 53.23,80.64 R0638.1
20MHZ_XON  (via drill 0.3)
  Top 0.203: C0716.1 71.75,76.42 arc90 R0751.1 arc45 71.87,76.16 71.05,75.34 arc-45 70.83,75.25 70.78,75.25 arc45 70.55,75.16 v70.09,74.77 | R0639.2 57.18,79.38 arc45 57.4,79.47 58.96,81.03 arc45 59.05,81.25 v59.05,82.23
  Layer_2 0.203: v70.09,74.77 69.5,74.77 arc-45 69.28,74.86 68.67,75.47 arc-45 68.58,75.7 68.58,78.24 arc60 68.42,78.51 61.51,82.51 arc30 61.35,82.55 59.63,82.55 arc35 59.45,82.49 59.08,82.23 v59.05,82.23
20MHZ_XOP  (via drill 0.3)
  Top 0.203: v70.01,75.56 70.18,75.73 arc45 70.27,75.96 R0751.2 70.39,76.32 arc45 70.48,76.55 C0715.1 | R0638.2 57.18,80.64 arc45 57.4,80.74 58.17,81.5 arc45 58.26,81.73 58.26,82.58 arc-45 58.35,82.8 v58.58,83.03
  Layer_2 0.203: v70.01,75.56 69.85,78.08 arc59 69.69,78.36 64.92,81.19 arc-59 64.77,81.46 64.77,83.37 arc45 64.68,83.59 63.91,84.36 arc45 63.69,84.45 61.73,84.45 arc-45 61.5,84.55 61.21,84.84 arc45 60.99,84.93 59.69,84.93 arc53 59.44,84.8 58.64,83.75 arc37 58.58,83.56 v58.58,83.03
+1V2  (via drill 0.3)
  Top 0.406: v51.44,37.31 51.44,37.33 arc45 51.34,37.56 TP_+1V2.TP | v59.53,36.67 v59.53,40.01
  Bottom 0.203: 59.53,39.68 v59.53,40.01 | v59.53,36.67 59.53,36.04 57.47,36.04 arc90 57.15,35.72 L0433.1
  Bottom 0.305: U1901.1 arc-45 56.13,37.94 54.67,37.94 arc90 C1901.1
  Bottom 0.406: 54.61,35.24 52.13,35.24 arc45 U0431.4 arc-90 52.07,35.26 52.07,36.54 arc45 51.98,36.76 v51.44,37.31 51.05,37.69 | 54.61,35.24 56.67,35.24 56.71,35.28 arc-45 56.93,35.37 L0433.1 | 50.83,37.78 arc-45 51.05,37.69 | C0444.1 50.83,37.78 | 50.83,37.78 arc-45 51.05,37.69 | C1901.1 54.61,35.24 | U1901.5 arc90 59.53,39.68
+3V0_20MHZ_VCTCXO  (via drill 0.3)
  Top 0.203: C0611.1 39.15,84.89 arc45 39.38,84.8 U0611.1 41.03,84.87 arc-45 41.12,85.1 41.98,85.95 arc-45 42.2,86.04 51.5,86.04 arc-45 51.72,85.95 U0631.4 | U0631.4 U0631.4 arc-90 53.54,84.77 55.21,84.77 arc90 U0601.5 | U0631.4 arc-66 v52.7,83.66
  Bottom 0.203: C0631.1 52.97,83.4 arc-90 v52.7,83.66
+3V3  (via drill 0.3)
  Top 0.203: 6.35,18.73 4.16,18.73 arc90 3.84,18.41 U1311.4 3.84,16.42 | 7.62,17.05 7.62,18.57 7.55,18.64 arc45 7.33,18.73 6.35,18.73 | U1311.2 arc45 6.35,17 6.35,18.73 | C1311.1 2.55,15.94 arc-45 2.77,16.03 v3.97,16.03 | U1321.6 6.12,9.37 arc-90 5.8,9.05 5.56,9.05 | 5.56,9.05 4.13,9.05 arc-90 3.81,9.37 | C1321.1 3.81,9.37 | U1321.5 5.62,9.11 arc-90 5.56,9.05 | v51.75,46.99 TP_+3V3.TP | R0311.1 v45.09,55.56 | U0111.106 75.56,69.95 arc45 v75.42,69.94 v75.41,69.93 | U0601.4 57.44,85.16 arc45 57.22,85.25 v56.83,85.25 | 3.81,9.37 3.74,9.3 arc-45 3.52,9.21 v3.02,9.21
  Top 0.406: U1311.1 arc45 7.62,17.05 | v3.97,16.03 3.9,16.1 arc-45 3.81,16.32 3.81,16.35 arc45 3.84,16.42
  Layer_2 0.203: X2312.37 X2312.38
  Bottom 0.152: C1302.1 45.44,26.45 arc-45 45.66,26.36 45.72,26.3 | C0431.1 | v47.48,33.35 47.48,33.41 arc45 C0432.1
  Bottom 0.203: v89.53,22.7 C0999.1 arc-45 89.61,22.61 v89.53,22.7 | v89.53,22.7 88.27,22.7 88.27,22.64 U0991.6 | U0921.6 86.04,13.96 arc-90 86.36,13.64 C0921.1 arc-90 86.52,12.76 v86.36,12.7 | U0911.6 83.41,26.47 arc-90 C0911.1 arc-45 83.43,26.74 v83.34,26.51 | U0901.16 68.85,34.61 arc90 68.53,34.92 67.02,34.92 arc-45 66.8,35.02 C1001.1 v66.83,35.24 | U0801.3 62.88,15.83 arc45 62.97,15.61 63.18,15.4 arc-4 C0803.2 arc98 v63.98,14.61 | v67.47,20.95 67.57,21.11 arc-90 C0802.2 | U0801.24 66.55,20.34 arc38 66.75,20.4 v67.47,20.95 | v67.47,20.95 67.64,21.28 arc45 67.73,21.51 C0801.1 | v56.67,22.23 C0804.2 56.83,22.23 arc90 57.15,22.54 58.94,22.54 arc-90 59.26,22.23 U0801.14 | v45.09,26.19 arc-90 45.2,26.3 45.72,26.3 U1301.13 47.1,26.3 arc90 47.15,26.35 48.42,26.35 | v47.48,33.35 arc90 v47.47,33.34 48.37,32.44 arc-45 48.46,32.21 U1301.22 48.46,28.26 | 48.42,26.35 48.74,26.35 arc-90 48.86,26.23 U1301.8 48.86,25.41 arc45 48.95,25.18 49.44,24.7 arc-45 49.69,24.32 v49.69,23.81 C1301.1 | 48.46,28.26 48.46,26.45 arc-45 48.42,26.35 | U1301.1 arc-90 49.77,28.26 48.46,28.26 | 50.71,33.56 50.59,33.44 | 49.15,35.59 arc-45 49.05,35.81 | 4.76,15.88 R1331.2 R1332.2 | D0451.A v36.04,56.52 | v56.83,85.25 56.83,84.69 arc45 56.92,84.47 C0601.1 arc45 56.76,84.38 56.52,84.14 56.52,81.63 arc-45 56.42,81.4 R0321.1 | C1902.1 arc90 61.38,37.78 v63.82,37.78
  Bottom 0.3: C1231.1 48.37,11.91 arc45 48.28,11.69 U1201.5
  Bottom 0.305: 36.67,49.53 arc90 36.55,49.41 U1701.8 37.15,47.74 arc-90 37.47,47.42 | 37.47,47.42 37.47,46.56 arc-90 37.15,46.24 U1701.5 | 37.47,47.42 arc-90 37.78,47.74 U1701.1 arc90 40.01,48.09 v40.01,48.26 | U1801.8 arc90 44.29,47.86 44.29,49.05 arc-90 v44.77,49.53 C1801.1 46.57,47.83 arc45 46.79,47.74 U1801.1 | U1801.5 43.97,46.24 arc90 43.66,45.92 v43.66,45.88 | C1902.1 59.44,37.88 arc-90 U1901.8
  Bottom 0.406: C0431.1 v47.48,33.35 U0431.1 50.36,33.35 arc45 50.59,33.44 | 50.71,33.56 arc45 50.8,33.79 50.8,34.92 arc90 50.49,35.23 U0431.3 49.15,35.59 | 49.05,35.81 v49.05,35.88 | C0431.1 42.93,33.09 arc-45 42.7,32.99 U1601.4 arc-45 39.05,32.96 39.05,32.36 arc-45 38.96,32.13 38.19,31.37 arc-45 37.97,31.27 29.82,31.27 arc-45 29.59,31.37 28.98,31.98 arc-45 28.89,32.2 28.89,35.07 arc-45 28.98,35.3 L1604.1 arc45 31.65,38.1 28.39,38.1 arc-45 28.16,38.19 27.71,38.64 arc-45 27.62,38.87 27.62,39.14 arc45 C1605.1 C1605.1 arc45 27.62,39.6 C1606.1 v27.94,41.91 | 4.76,15.88 4.7,15.94 arc45 4.47,16.03 v3.97,16.03 | C1701.1 36.67,49.53 36.11,49.53 arc-90 35.8,49.85 C1607.+ | SJ0401.1 v58.26,60.01 | v62.31,63.5 SJ0421.2
  other vias: 43.18,33.34
  pour Layer_15: 0.64,0.64 0.64,95.89 95.89,95.89 95.89,0.64
+3V3_20MHZ  (via drill 0.3)
  Top 0.203: TP_+3V3_20MHZ.TP 55.88,48.1 arc90 55.56,48.42 45.88,48.42 arc90 45.56,48.1 v45.56,47.94 | U0611.7 44.11,84.14 arc45 43.89,84.05 v43.66,83.82 | C0641.1 arc-45 42.16,81.38
  Top 0.305: v45.56,47.94 45.34,47.72 arc45 45.24,47.49 v45.24,46.35 | C0641.1 42.12,81.04 arc45 42.22,80.81 42.23,80.8 43.18,80.8 | 42.16,81.38 43.56,82.78 arc45 43.66,83 v43.66,83.82 | v43.18,48.74 43.18,80.17 | 43.18,80.17 43.18,80.8 | 43.18,80.8 43.34,80.8 R0613.1 | R0611.1 37.25,81.63 arc45 37.34,81.4 38.48,80.26 arc45 38.71,80.17 43.18,80.17
  Bottom 0.203: C0612.1 arc45 43.77,83.7 v43.66,83.82
  Bottom 0.305: C1803.1 arc90 43.02,48.52 43.02,46.99 arc90 43.27,46.74 U1801.6 44.93,46.74 arc-90 45.24,46.42 v45.24,46.35 | U1801.2 46.55,47.24 arc-45 46.33,47.33 45.81,47.85 arc45 45.59,47.94 v45.56,47.94 | U0641.5 arc-90 43.81,82.83 C0612.1
  Bottom 0.406: C1803.1 v43.18,48.74
+3V3_HICUR  (via drill 0.3)
  Top 0.152: 70.48,82.55 70.49,82.55 arc-45 U0701.7 | 72.61,78.67 v72.55,78.74
  Top 0.203: TP_+3V3_HICUR.TP 53.34,47.62 arc90 53.02,47.94 48.74,47.94 arc90 48.42,47.62 48.42,45.09 arc-90 48.1,44.77 42.68,44.77 arc-43 42.46,44.85 40.26,46.91 arc43 40.04,46.99 v38.73,46.99 | U0701.24 arc90 66.2,82.14 v66.2,81.44 | v70.48,81.92 70.48,82.55 | v65.96,84.59 U0701.20 | U0701.15 68.83,86.11 arc90 v68.58,86.36 arc90 68.33,86.11 U0701.16 | U0701.11 71.08,84.57 arc90 v71.37,84.85 | 70.8,81.92 72.77,79.94 arc45 73,79.85 74.37,79.85 | 85.88,70.19 arc45 85.79,70.26 85.66,70.39 | 78.74,81.92 79.06,81.6
  Top 0.305: v38.73,46.99 38.35,46.61 arc-45 38.13,46.51 v35.72,46.51 | 72.61,78.67 arc45 72.52,78.82 v74.37,78.82 74.37,79.85 74.37,80.59 arc-45 74.47,80.82 75.47,81.82 arc-45 75.7,81.92 78.61,81.92 arc-45 78.83,81.82 79.06,81.6 80.39,80.26 arc-45 80.49,80.04 v80.49,78.42 | 70.8,81.92 v70.48,81.92 | v68.58,86.36 68.58,87.31 arc-90 68.98,87.95 75.49,87.95 arc53 75.82,88.08 75.95,88.22 arc-53 76.2,88.42 77.45,88.42 arc-42 77.66,88.34 v78.11,87.95 78.65,87.41 arc-45 78.74,87.18 78.74,81.92 | 85.88,70.19 v85.88,70.17 85.88,70.1 arc45 85.98,69.88 86.24,69.61 arc45 86.47,69.52 93.54,69.52 arc-45 93.77,69.43 v93.82,69.37 | 85.66,70.39 arc-45 85.57,70.78 85.57,76.07 arc-45 85.66,76.29 86.27,76.9 arc45 86.36,77.12 v86.36,80.17 | v41.27,48.74 41.27,55.11 arc-45 41.37,55.34 41.82,55.79 arc45 41.91,56.01 41.91,77.34 arc45 41.82,77.56 40.73,78.65 arc45 40.51,78.74 38.23,78.74 arc-45 38.01,78.83 35.65,81.19 arc-45 35.56,81.41 35.56,86.23 arc-45 35.65,86.45 35.78,86.58 arc-45 36.01,86.68 46.39,86.68 arc42 46.6,86.76 48.17,88.17 arc45 48.26,88.56 48.26,89.56 arc-45 48.35,89.79 49.91,91.35 arc-45 50.14,91.44 80.33,91.44 arc-90 81.28,90.49 v81.28,88.74
  Bottom 0.152: U1111.3 75.15,77.86 arc-45 74.93,77.95 v74.37,78.82 | 71.91,78.11 L1112.2 | v41.27,48.74 C1703.1 | 70.08,84.68 71.19,84.68 arc90 v71.37,84.85
  Bottom 0.203: C0701.1 66.13,81.61 arc-45 v66.2,81.44 | 67.47,84.61 C0705.2 arc-88 v65.96,84.59 | 68.58,84.93 C0704.1 | C0703.1 69.85,84.45 | 69.85,84.45 arc90 69.53,84.77 68.9,84.77 68.9,84.99 arc90 C0704.1 | C0704.1 v68.58,86.36 | 69.85,84.45 70.08,84.68 | U1101.19 78.34,86.36 78.34,87.15 78.29,87.42 | L1112.2 C1111.1 | U1111.15 80.42,78.36 arc90 v80.49,78.42 | U1131.5 90.58,80.21 arc51 90.33,80.33 86.36,80.33 v86.36,80.17 | U1141.5 86.03,69.52 arc-45 85.8,69.61 85.48,69.81 arc31 85.32,69.85 84.47,69.85 arc15 84.39,69.84 84.01,69.69 arc11 83.95,69.69 U1121.5 | 78.11,88.03 v78.11,87.95
  Bottom 0.305: U1701.6 35.95,46.74 arc90 v35.72,46.51 | v38.73,46.99 arc-90 38.98,47.24 U1701.2 40.96,47.24 arc90 41.27,47.56 C1703.1 | C0702.1 v70.48,81.92 | v66.2,81.44 67.38,82.62 arc45 67.47,82.84 67.47,84.61 arc-90 67.79,84.93 68.58,84.93 | 78.29,87.42 arc-45 L1102.2 78.2,87.81 arc-45 78.11,88.03 C1101.1 arc-90 78.42,89 78.42,88.9 arc90 78.58,88.74 v81.28,88.74 | v72.55,78.74 71.91,78.11 | 80.42,78.36 82.57,78.42 arc49 82.8,78.53 84.2,80.21 arc-50 84.44,80.33 86.36,80.33 | 85.8,69.61 arc90 85.88,69.69 v85.88,70.17 | C1129.1 87.63,79.22 86.93,80.08 arc45 86.7,80.17 v86.36,80.17 | C1128.1 93.92,69.33 arc45 v93.82,69.37
+5V0  (via drill 0.3)
  Top 0.203: TP_+5V0.TP v50.01,45.09
  Top 0.406: X2331.37 X2331.38 | X2311.38 X2311.37 | X2321.38 X2321.37 8.92,44.45 arc-45 9.14,44.36 v14.76,38.73 16.58,36.92 arc45 16.8,36.83 v17.3,36.83
  Bottom 0.203: 37.15,40.42 39.18,42.45 arc-45 39.4,42.55 47.49,42.55 arc45 47.72,42.64 49.51,44.43 arc8 49.54,44.47 v50.01,45.09
  Bottom 0.406: U1601.3 39.04,34.75 arc-90 38.73,34.45 37.48,34.45 arc-90 37.16,34.77 U1601.1 arc-90 U1601.1 C1602.1 37.15,40.42 arc45 37.06,40.65 C1601.+ 35.05,42.66 arc45 34.82,42.75 D1501.C 32.37,43.41 arc45 32.14,43.5 24.74,43.5 arc45 24.51,43.41 23.43,42.18 arc-49 23.19,42.07 15.53,42.07 arc45 15.31,41.98 14.86,41.53 arc45 14.76,41.3 v14.76,38.73 | v17.3,36.83 R1409.2 | X2311.38 44.45,93.48 arc-45 44.36,93.25 43.91,92.8 arc-45 43.68,92.71 17.91,92.71 arc45 17.69,92.62 1.36,76.29 arc45 1.27,76.07 1.27,44.45 | 1.27,44.45 X2321.38 | 1.27,44.45 1.27,14.26 arc45 1.36,14.04 5.46,9.94 arc45 5.69,9.84 7.01,9.84 arc-45 7.24,9.75 15.62,1.36 arc45 15.85,1.27 52.07,1.27 X2331.38
+5V1_SOL  (via drill 0.3)
  Top 0.406: TP_+5V0_SOL.TP 15.74,43.81 arc-45 15.97,43.72 19.43,40.26 arc-45 19.53,40.03 v19.53,39.37
  Bottom 0.406: R1409.1 15.78,36.71 arc-45 15.88,36.48 15.88,36.17 arc45 15.97,35.94 16.68,35.23 arc45 16.9,35.14 R1408.2 16.86,35.14 arc45 16.63,35.05 15.97,34.38 arc45 15.88,34.16 15.88,28.7 arc42 15.96,28.48 R1405.2 | R1406.2 v19.53,39.37 18.86,39.37 arc45 18.64,39.28 17.87,38.51 arc-45 17.65,38.42 16.48,38.42 arc45 16.26,38.33 15.75,37.82 arc45 15.66,37.59 R1409.1 | C1406.1 15.21,37.15 arc-45 15.43,37.06 R1409.1
AD_VCTCXO1
  Bottom 0.203: U0641.1 46.47,82.22 arc45 46.25,82.13 45.81,81.69 arc45 45.72,81.47 45.72,80.96 arc-53 45.59,80.71 45.17,80.39 arc-38 44.98,80.33 U0641.4 44.42,79.06 arc-45 44.33,78.84 R0642.1
AUDIO_IN_L
  Bottom 0.203: C1104.1 91.6,81.54 arc45 91.82,81.45 X2201.2
AUDIO_IN_R
  Bottom 0.152: C1105.1 85.25,81.54 arc45 85.47,81.45
  Bottom 0.203: 85.47,81.45 X2201.3
AUDIO_OUT_L
  Bottom 0.203: C1132.2 92.71,71.83 arc-45 92.62,71.61 X2211.2
AUDIO_OUT_L_OP
  Bottom 0.203: U1131.4 89.86,78.7 arc45 89.96,78.48 91.6,76.83 91.6,76.45 arc45 91.69,76.23 U1131.1 91.82,76.1 arc-45 91.92,75.87 91.92,75.56 92.62,74.86 arc-45 92.71,74.64 C1132.1
AUDIO_OUT_R
  Bottom 0.203: C1142.2 88.51,71.2 arc45 88.28,71.29 X2211.3
AUDIO_OUT_R_OP
  Bottom 0.152: 89.46,69.61 arc-45 89.23,69.52 U1141.1 88.87,69.47 arc-45 88.65,69.37 | 90.33,70.83 arc-45 90.42,71.06 C1142.1 | U1141.4 86.4,67.64 arc45 86.62,67.73
  Bottom 0.203: 89.46,69.61 90.33,70.48 90.33,70.83 | 86.62,67.73 88.27,69.37 88.65,69.37
AX_8MHZ  (via drill 0.3)
  Top 0.152: R0714.1 69.22,78.49 arc45 69.15,78.65 arc45 68.92,78.74 64.9,78.74 arc-45 64.68,78.83 v63.98,79.53
  Top 0.203: v67.79,27.3 85.59,27.3 arc45 85.82,27.4 86.27,27.85 arc45 86.36,28.07 v86.36,38.26 | v63.26,66.91 68.05,66.91 arc-45 68.28,66.82 74.76,60.34 arc45 74.82,60.33 v74.93,60.33 | 69.22,77.79 R0714.1
  Layer_2 0.203: v63.98,79.53 64.29,79.53 arc-90 64.77,79.06 64.77,71.49 arc-45 64.76,71.27 63.26,69.77 v63.26,66.91
  Layer_15 0.203: v87,57.15 87,54.27 arc45 87.09,54.04 89.44,51.69 arc-45 89.53,51.46 89.53,42.84 arc-45 89.44,42.61 86.45,39.62 arc45 86.36,39.4 v86.36,38.26
  Bottom 0.203: R1021.2 arc-90 68.48,27.3 v67.79,27.3 | v74.93,60.33 75.91,60.33 arc-45 76.13,60.23 77.22,59.15 arc45 77.44,59.05 81.62,59.05 arc-45 81.85,58.96 81.98,58.83 arc45 82.2,58.74 82.58,58.74 arc45 82.8,58.83 82.93,58.96 arc-45 83.16,59.05 86.68,59.05 arc-90 87,58.74 v87,57.15
AX_ADC1  (via drill 0.3)
  Layer_2 0.203: v66.2,29.21 66.2,30.64 arc-90 66.52,30.96 66.99,30.96 arc90 67.31,31.27 67.31,34.16 arc-45 67.4,34.38 68.49,35.47 arc-45 68.71,35.56 v68.74,35.56
  Bottom 0.203: v66.2,29.21 TP_AX_ADC1.TP R1031.1 | U0901.17 69.35,34.66 arc45 69.26,34.88 68.83,35.31 arc-45 68.74,35.53 v68.74,35.56
AX_ADC2  (via drill 0.3)
  Layer_15 0.203: v66.2,27.94 67.18,27.94 arc45 67.4,28.03 69.6,30.23 arc45 69.69,30.45 69.69,31.14 arc-45 69.78,31.37 70.39,31.98 arc45 70.48,32.2 70.48,32.73 arc45 70.39,32.95 69.78,33.56 arc-45 69.69,33.79 v69.69,35.24
  Bottom 0.203: v66.2,27.94 TP_AX_ADC2.TP R1032.1 | U0901.18 69.85,34.95 arc45 69.76,35.18 v69.69,35.24
AX_ANTN
  Bottom 0.203: U0901.4 71.83,31.89 arc-90 C_AX_C2.1 L_AX_C2.1 74.93,30.56 arc-45 75.02,30.79 C_AX_T2.1
AX_ANTP
  Bottom 0.203: C_AX_T1.1 75.25,33.66 arc-90 74.93,33.97 L_AX_C1.1 C_AX_C1.1 73.66,34.29 arc-90 71.75,32.38 U0901.3
AX_B1
  Bottom 0.203: L_AX_B1.1 C_AX_M1.1 L_AX_T1.2
AX_B2
  Bottom 0.203: C_AX_B2.1 L_AX_T2.2 arc-101 80.64,31.11 L_AX_B2.2 C_AX_M2.1
AX_CLK16N
  Bottom 0.203: U0901.19 70.35,35.41 arc45 70.26,35.63 68.2,36.74 arc-45 67.94,37.28 67.94,38.1 arc53 67.63,38.73 arc3 Q0911.1
AX_CLK16P
  Bottom 0.203: U0901.20 70.85,36.5 arc45 70.76,36.72 Q0911.3
AX_COMB
  Bottom 0.203: C_AX_F2.1 87.31,33.12 arc-90 L_AX_F1.1 | C_AX_A2.1 86.36,32.8 arc90 C_AX_F2.1 | C_AX_F2.1 85.6,33.56 arc45 85.38,33.66 L_AX_B1.2 C_AX_B2.2
AX_GPIO1
  Bottom 0.203: U0901.15 66.94,33.38 arc-90 TP_AX_TCXO_EN.TP R1061.2
AX_IRQ
  Bottom 0.203: U0901.14 66.99,32.88 arc90 66.67,32.57 TP_AX_IRQ.TP R1051.2
AX_L1
  Bottom 0.203: U0901.8 69.85,28.26 arc90 70.17,27.94 arc90 70.38,27.73 L_AX_1.1
AX_L2
  Bottom 0.203: U0901.7 70.35,30.01 arc45 70.44,29.79 L_AX_1.2
AX_SYSCLK
  Bottom 0.203: U0901.9 69.35,29.84 arc-90 69.03,29.53 68.9,29.53 68.9,29.43 arc-90 R1021.1
AX_T1
  Bottom 0.203: L_AX_T1.1 C_AX_T1.2
AX_T2
  Bottom 0.203: C_AX_T2.2 L_AX_T2.1
AX_VDD1
  Bottom 0.203: U0901.1 71.8,33.38 71.98,33.56 arc45 72.07,33.79 C1002.2
AX_VDD5
  Bottom 0.203: C1003.2 72.39,31.07 arc90 72.07,31.39 U0901.5
CH1_ANT
  Bottom 0.152: L0995.2 91.44,20.32
  Bottom 0.203: C0996.1 91.44,20.32 X2101.1
CH2_ANT
  Bottom 0.203: C_AX_A3.1 X2111.1 | X2111.1 L_AX_F1.2 | C_AX_F2.2 85.72,37.15 arc-90 86.04,37.47 91.12,37.47 arc-90 91.44,37.15 X2111.1
CLK0_N  (via drill 0.3)
  Top 0.3: v63.18,83.82 R0743.2
  Layer_15 0.152: 42.55,6.8 42.55,7.81 | 42.45,8.03 42.16,8.32
  Layer_15 0.203: 42.64,6.58 arc-45 42.55,6.8 | 42.55,7.81 arc45 42.45,8.03 | 42.16,8.32 arc45 41.94,8.41 41.43,8.41 arc-90 41.27,8.57
  Layer_15 0.3: v63.18,83.82 arc45 63,83.75 62.02,82.77 arc45 61.93,82.54 61.93,79.79 arc-45 61.84,79.56 59.82,77.55 arc-45 59.59,77.45 55.41,77.45 arc45 55.19,77.36 48.07,70.24 arc-45 47.84,70.15 44.46,70.15 arc45 44.23,70.06 42.97,68.8 arc45 42.88,68.57 42.88,56.14 arc-45 42.79,55.91 37.73,50.7 arc45 37.48,50 37.48,44.14 arc45 37.73,43.44 40.09,40.93 arc-45 40.18,40.7 40.18,9.8 arc45 40.27,9.57 41.27,8.57 | X2332.4 44.45,4.63 arc45 44.36,4.86 42.64,6.58
CLK0_P  (via drill 0.3)
  Top 0.3: v63.18,82.55 R0744.2
  Layer_15 0.3: v63.18,82.55 62.79,82.55 arc54 62.53,82.42 | 62.6,82.5 62.53,82.43 arc45 62.53,82.42 | 62.53,82.42 62.53,79.54 arc-45 62.44,79.32 60.07,76.94 arc-45 59.84,76.85 55.66,76.85 arc45 55.44,76.76 48.32,69.64 arc-45 48.09,69.55 44.71,69.55 arc45 44.48,69.46 43.57,68.55 arc45 43.48,68.32 43.48,55.89 arc-45 43.39,55.66 38.33,50.45 arc45 38.08,49.75 38.08,44.39 arc45 38.33,43.69 40.69,41.17 arc-45 40.78,40.95 40.78,10.15 arc45 40.87,9.93 41.82,8.98 arc45 42.04,8.89 43.84,8.89 arc-45 44.07,8.8 44.29,8.57 44.29,7.91 arc45 44.38,7.69 X2332.3
CLK1_N  (via drill 0.3)
  Top 0.3: v63.18,86.36 R0735.2
  Layer_15 0.152: 8.73,53.5 7.94,52.7 6.51,52.7
  Layer_15 0.3: v63.18,86.36 60.25,86.36 arc-45 60.02,86.45 59.81,86.66 48.27,86.66 arc45 48.04,86.57 16.48,55 arc-45 16.25,54.91 10.16,54.91 arc45 10.13,54.9 8.73,53.5 | 6.51,52.7 3.94,52.7 arc45 3.72,52.61 3.43,52.32 arc-45 3.2,52.23 2.83,52.23 arc45 2.61,52.14 X2322.4
CLK1_P  (via drill 0.3)
  Top 0.3: v63.18,85.09 R0736.2
  Layer_15 0.3: v63.18,85.09 62.63,85.5 arc37 62.44,85.57 60.26,85.57 arc-34 60.09,85.62 59.52,86.01 arc34 59.34,86.06 48.52,86.06 arc45 48.29,85.97 16.73,54.4 arc-45 16.5,54.31 10.52,54.31 arc16 10.44,54.3 10.36,54.28 arc29 10.22,54.2 8.19,52.16 arc-45 7.96,52.07 X2322.3
CLK2_N  (via drill 0.3)
  Top 0.3: v73.82,85.09 R0731.2
  Layer_15 0.152: v73.82,85.09 74.69,86.25 arc48 74.74,86.82 74.35,87.39 arc-34 74.3,87.57 74.3,91.28
  Layer_15 0.3: X2312.4 52.07,92.84 arc44 52.16,92.62 52.61,92.15 arc46 52.84,92.06 72.29,92.06 arc1 72.3,92.06 73.52,92.06 arc-90 74.3,91.28
CLK2_P  (via drill 0.3)
  Top 0.3: v73.82,86.36 R0732.2
  Layer_15 0.152: v73.82,86.36 73.03,87.95 73.03,90.96
  Layer_15 0.3: 73.03,90.96 72.64,91.35 arc44 72.42,91.44 71.79,91.46 52.84,91.46 arc46 52.61,91.36 52.16,90.9 arc44 52.07,90.68 X2312.3
EVT_N  (via drill 0.3)
  Top 0.203: R2314.2 v59.37,78.26 | v40.8,71.6 40.8,74.96 arc45 40.71,75.18 34.38,81.5 arc-45 34.29,81.73 34.29,86.39 arc-45 34.38,86.61 34.83,87.06 arc-45 35.06,87.15 38.76,87.15 arc45 38.99,87.25 39.28,87.54 arc45 39.37,87.76 X2311.29
  Layer_15 0.203: v59.37,78.26 55.18,78.26 arc34 55.01,78.21 54.69,78 arc-34 54.51,77.95 53.91,77.95 arc-34 53.74,78 53.42,78.21 arc34 53.24,78.26 51.41,78.26 arc45 51.18,78.17 44.7,71.69 arc-45 44.48,71.6 v40.8,71.6
EVT_S  (via drill 0.3)
  Top 0.203: R2334.2 81.56,62.16 arc45 81.78,62.07 v82.39,62.07
  Layer_15 0.203: v82.39,62.07 81.12,62.07 arc54 80.87,61.94 77.66,57.51 arc17 77.61,57.42 76.2,53.18 75.72,49.05 69.23,17.07 arc-32 69.15,16.92 68.22,15.68 arc-20 68.13,15.61 67.18,12.21 arc-65 66.68,11.76 63.43,11.21 arc16 63.26,11.15 57.48,8.42 arc63 57.15,8.3 X2331.29
EVT_W  (via drill 0.3)
  Top 0.203: R2324.2 50.32,60.96 arc-90 50.16,61.12 v48.74,61.12
  Layer_2 0.203: v48.74,61.12 47.28,61.12 arc45 47.06,61.03 40.73,54.7 arc-45 40.51,54.61 v33.97,54.61
  Bottom 0.203: X2321.29 8.8,40.55 arc45 8.89,40.77 8.89,53.21 arc-45 8.98,53.43 10.07,54.52 arc-45 10.29,54.61 v33.97,54.61
GND  (via drill 0.3)
  Top 0.152: R1110.1 v77.15,89.06
  Top 0.203: U1311.3 arc-45 5.08,17 v5.08,17.94 | U1321.7 6.62,9.1 arc90 v6.83,8.89 arc90 7.12,9.18 U1321.8 | U1321.2 arc-90 6.67,11.92 6.67,11.27 arc90 6.37,10.97 U1321.9 | U0111.143 57.84,74.58 arc45 57.75,74.81 | 57.75,74.81 57.56,75 arc-45 57.47,75.22 57.47,76.83 arc-54 57.6,77.09 C1909.2 | v57.78,74.77 57.75,74.81 | U0111.130 64.31,71.86 arc45 64.49,71.24 v65.01,70.72 | U0111.71 74.34,52.66 arc90 v74.3,52.78 | U0111.61 69.21,52.33 arc-7 69.21,52.37 69.21,53.3 arc64 69.04,53.59 v68.74,53.74 | U0111.51 64.3,52.27 arc42 64.21,52.47 64.07,52.61 arc-45 63.98,52.84 v64.06,53.66 | U0111.38 arc-45 57.78,51.74 57.86,53.11 arc-45 57.96,53.33 C0402.2 v58.34,53.66 | C0441.1 R0441.1 49.64,50.59 arc-45 49.42,50.68 C1607.- | U0111.16 56.2,63.58 58.42,63.58 58.56,63.61 arc45 58.39,63.55 v58.58,63.58 | v69.37,71.75 69.36,72.25 arc-45 69.27,72.47 U0111.120 | S0312.1 v46.99,67.63 46.99,70.64 47.37,71.02 arc45 C0511.2 | U0111.107 75.19,70.53 arc45 74.49,70.28 v73.66,69.69 | U0111.94 75.88,63.98 v73.66,63.98 | SJ0121.1 v49.21,56.83 48.77,56.39 arc-45 48.55,56.3 C0313.2 | U0611.8 45.33,85.17 arc90 45.01,85.49 v44.93,85.41 | C0622.2 arc-90 48.58,79.38 v49.85,79.38 U0631.2 | C0641.2 40.34,81.19 arc-45 v40.16,81.12 | R0612.1 37.08,83.99 arc-45 36.99,84.21 v36.99,84.45 36.99,84.7 arc-45 37.08,84.92 C0611.2 | U0601.2 56.52,82.89 arc-45 56.61,83.12 57.06,83.57 arc-45 57.28,83.66 60.03,83.66 arc45 60.26,83.75 X0322.2 | C0531.+ v51.44,77.15 | R0639.1 54.8,79.15 arc-45 54.58,79.06 v54.29,79.06 | U0701.23 arc-45 66.52,83.03 v66.09,83.06 | C2003.1 C2003.1 arc45 87.86,63.82 | R2002.1 R2002.1 arc-45 89.3,63.82
  Top 0.203: C1321.2 3.09,11.17 arc-45 2.87,11.26 v2.22,11.91 2.16,11.97 arc-45 2.06,12.2 C1311.2 | U0111.83 74.28,58.5 arc24 74.16,58.47 v73.66,58.26
  Top 0.305: 87.86,63.82 v88.58,63.82 89.3,63.82
  Top 0.406: v57.78,40.96 R1902.1 | X2001.GND 90.06,63.53 arc-45 89.83,63.62 R2002.1